# Vivado block design design_1, xczu28dr-ffvg1517-2-e, Vivado 2021.1
# (continued, part 2 of 8)
current_bd_instance /chan1/GPIO

# ---- hierarchy /chan1/psb_out_post ----
current_bd_instance /chan1/psb_out_post
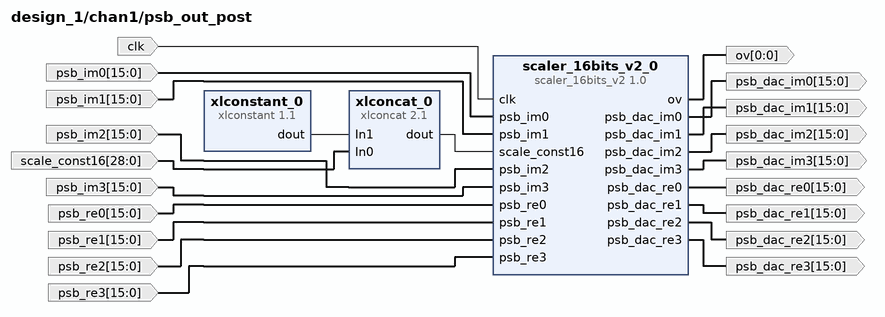
[diagram p11: block diagram inside /chan1/psb_out_post]
create_bd_pin -dir I -from 15 -to 0 psb_im0
create_bd_pin -dir I -from 15 -to 0 psb_im1
create_bd_pin -dir I -from 15 -to 0 psb_im2
create_bd_pin -dir I -from 15 -to 0 psb_im3
create_bd_pin -dir I -from 15 -to 0 psb_re0
create_bd_pin -dir I -from 15 -to 0 psb_re1
create_bd_pin -dir I -from 15 -to 0 psb_re2
create_bd_pin -dir I -from 15 -to 0 psb_re3
create_bd_pin -dir I -from 28 -to 0 scale_const16
create_bd_pin -dir I -type clk clk
create_bd_pin -dir O -from 15 -to 0 psb_dac_im0
create_bd_pin -dir O -from 15 -to 0 psb_dac_im1
create_bd_pin -dir O -from 15 -to 0 psb_dac_im2
create_bd_pin -dir O -from 15 -to 0 psb_dac_im3
create_bd_pin -dir O -from 15 -to 0 psb_dac_re0
create_bd_pin -dir O -from 15 -to 0 psb_dac_re1
create_bd_pin -dir O -from 15 -to 0 psb_dac_re2
create_bd_pin -dir O -from 15 -to 0 psb_dac_re3
create_bd_pin -dir O -from 0 -to 0 ov

create_bd_cell -type ip -vlnv xilinx.com:user:scaler_16bits_v2:1.0 scaler_16bits_v2_0
create_bd_cell -type ip -vlnv xilinx.com:ip:xlconcat:2.1 xlconcat_0
set_property -dict {CONFIG.IN0_WIDTH 29 CONFIG.IN1_WIDTH 3} [get_bd_cells xlconcat_0]
create_bd_cell -type ip -vlnv xilinx.com:ip:xlconstant:1.1 xlconstant_0
set_property -dict {CONFIG.CONST_VAL 0 CONFIG.CONST_WIDTH 3} [get_bd_cells xlconstant_0]

# ---- hierarchy /chan1/fine_nco ----
current_bd_instance /chan1/fine_nco
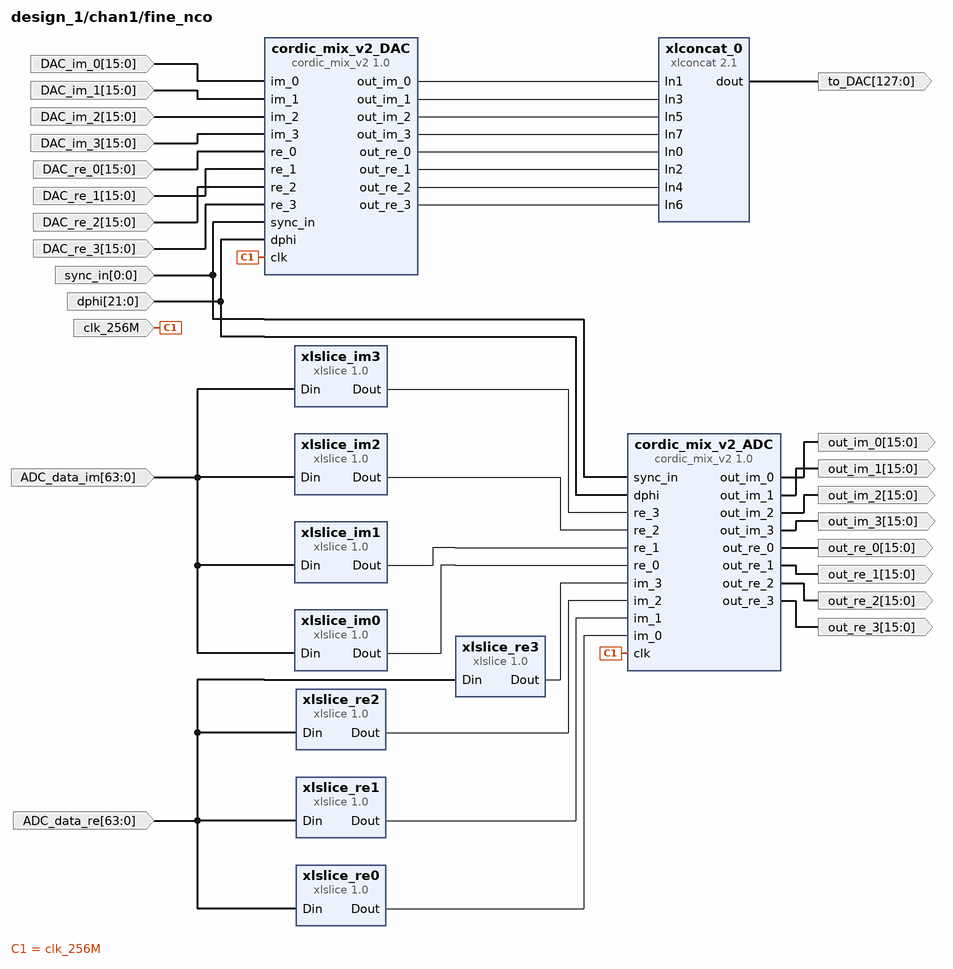
[diagram p12: block diagram inside /chan1/fine_nco]
create_bd_pin -dir I -from 63 -to 0 ADC_data_im
create_bd_pin -dir O -from 127 -to 0 to_DAC
create_bd_pin -dir I -from 63 -to 0 ADC_data_re
create_bd_pin -dir I -from 21 -to 0 dphi
create_bd_pin -dir I -from 0 -to 0 sync_in
create_bd_pin -dir I -type clk clk_256M
create_bd_pin -dir O -from 15 -to 0 out_im_0
create_bd_pin -dir O -from 15 -to 0 out_im_1
create_bd_pin -dir O -from 15 -to 0 out_im_2
create_bd_pin -dir O -from 15 -to 0 out_im_3
create_bd_pin -dir O -from 15 -to 0 out_re_0
create_bd_pin -dir O -from 15 -to 0 out_re_1
create_bd_pin -dir O -from 15 -to 0 out_re_2
create_bd_pin -dir O -from 15 -to 0 out_re_3
create_bd_pin -dir I -from 15 -to 0 DAC_im_0
create_bd_pin -dir I -from 15 -to 0 DAC_im_1
create_bd_pin -dir I -from 15 -to 0 DAC_im_2
create_bd_pin -dir I -from 15 -to 0 DAC_im_3
create_bd_pin -dir I -from 15 -to 0 DAC_re_0
create_bd_pin -dir I -from 15 -to 0 DAC_re_1
create_bd_pin -dir I -from 15 -to 0 DAC_re_2
create_bd_pin -dir I -from 15 -to 0 DAC_re_3

create_bd_cell -type ip -vlnv xilinx.com:ip:xlslice:1.0 xlslice_im0
set_property -dict {CONFIG.DIN_FROM 15 CONFIG.DIN_TO 0 CONFIG.DIN_WIDTH 64 CONFIG.DOUT_WIDTH 16} [get_bd_cells xlslice_im0]
create_bd_cell -type ip -vlnv xilinx.com:ip:xlslice:1.0 xlslice_im1
set_property -dict {CONFIG.DIN_FROM 31 CONFIG.DIN_TO 16 CONFIG.DIN_WIDTH 64 CONFIG.DOUT_WIDTH 16} [get_bd_cells xlslice_im1]
create_bd_cell -type ip -vlnv xilinx.com:ip:xlslice:1.0 xlslice_im2
set_property -dict {CONFIG.DIN_FROM 47 CONFIG.DIN_TO 32 CONFIG.DIN_WIDTH 64 CONFIG.DOUT_WIDTH 16} [get_bd_cells xlslice_im2]
create_bd_cell -type ip -vlnv xilinx.com:ip:xlconcat:2.1 xlconcat_0
set_property -dict [list \
  CONFIG.IN2_WIDTH 16 \
  CONFIG.IN3_WIDTH 16 \
  CONFIG.IN4_WIDTH 16 \
  CONFIG.IN5_WIDTH 16 \
  CONFIG.IN6_WIDTH 16 \
  CONFIG.IN7_WIDTH 16 \
  CONFIG.NUM_PORTS 8 \
] [get_bd_cells xlconcat_0]
create_bd_cell -type ip -vlnv xilinx.com:ip:xlslice:1.0 xlslice_re0
set_property -dict {CONFIG.DIN_FROM 15 CONFIG.DIN_TO 0 CONFIG.DIN_WIDTH 64 CONFIG.DOUT_WIDTH 16} [get_bd_cells xlslice_re0]
create_bd_cell -type ip -vlnv xilinx.com:ip:xlslice:1.0 xlslice_im3
set_property -dict {CONFIG.DIN_FROM 63 CONFIG.DIN_TO 48 CONFIG.DIN_WIDTH 64 CONFIG.DOUT_WIDTH 16} [get_bd_cells xlslice_im3]
create_bd_cell -type ip -vlnv xilinx.com:ip:xlslice:1.0 xlslice_re1
set_property -dict {CONFIG.DIN_FROM 31 CONFIG.DIN_TO 16 CONFIG.DIN_WIDTH 64 CONFIG.DOUT_WIDTH 16} [get_bd_cells xlslice_re1]
create_bd_cell -type ip -vlnv xilinx.com:ip:xlslice:1.0 xlslice_re2
set_property -dict {CONFIG.DIN_FROM 47 CONFIG.DIN_TO 32 CONFIG.DIN_WIDTH 64 CONFIG.DOUT_WIDTH 16} [get_bd_cells xlslice_re2]
create_bd_cell -type ip -vlnv xilinx.com:user:cordic_mix_v2:1.0 cordic_mix_v2_ADC
create_bd_cell -type ip -vlnv xilinx.com:user:cordic_mix_v2:1.0 cordic_mix_v2_DAC
create_bd_cell -type ip -vlnv xilinx.com:ip:xlslice:1.0 xlslice_re3
set_property -dict {CONFIG.DIN_FROM 63 CONFIG.DIN_TO 48 CONFIG.DIN_WIDTH 64 CONFIG.DOUT_WIDTH 16} [get_bd_cells xlslice_re3]

# ---- hierarchy /chan1/overflow_management ----
current_bd_instance /chan1/overflow_management
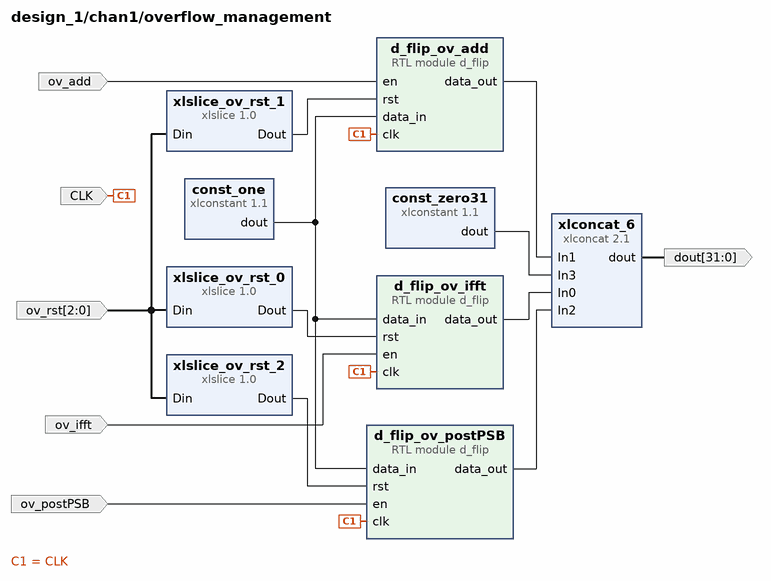
[diagram p13: block diagram inside /chan1/overflow_management]
create_bd_pin -dir I -type clk CLK
create_bd_pin -dir O -from 31 -to 0 dout
create_bd_pin -dir I ov_add
create_bd_pin -dir I ov_ifft
create_bd_pin -dir I ov_postPSB
create_bd_pin -dir I -from 2 -to 0 ov_rst

create_bd_cell -type ip -vlnv xilinx.com:ip:xlconstant:1.1 const_one
set_property -dict {CONFIG.CONST_VAL 1 CONFIG.CONST_WIDTH 1} [get_bd_cells const_one]
create_bd_cell -type ip -vlnv xilinx.com:ip:xlconstant:1.1 const_zero31
set_property -dict {CONFIG.CONST_VAL 0 CONFIG.CONST_WIDTH 29} [get_bd_cells const_zero31]
create_bd_cell -type module -reference d_flip d_flip_ov_add
set_property -dict {CONFIG.width 1} [get_bd_cells d_flip_ov_add]
create_bd_cell -type module -reference d_flip d_flip_ov_ifft
set_property -dict {CONFIG.width 1} [get_bd_cells d_flip_ov_ifft]
create_bd_cell -type module -reference d_flip d_flip_ov_postPSB
set_property -dict {CONFIG.width 1} [get_bd_cells d_flip_ov_postPSB]
create_bd_cell -type ip -vlnv xilinx.com:ip:xlconcat:2.1 xlconcat_6
set_property -dict [list \
  CONFIG.IN0_WIDTH 1 \
  CONFIG.IN1_WIDTH 1 \
  CONFIG.IN2_WIDTH 1 \
  CONFIG.IN3_WIDTH 29 \
  CONFIG.IN4_WIDTH 16 \
  CONFIG.IN5_WIDTH 16 \
  CONFIG.IN6_WIDTH 16 \
  CONFIG.IN7_WIDTH 16 \
  CONFIG.NUM_PORTS 4 \
] [get_bd_cells xlconcat_6]
create_bd_cell -type ip -vlnv xilinx.com:ip:xlslice:1.0 xlslice_ov_rst_0
set_property -dict {CONFIG.DIN_FROM 0 CONFIG.DIN_TO 0 CONFIG.DIN_WIDTH 3 CONFIG.DOUT_WIDTH 1} [get_bd_cells xlslice_ov_rst_0]
create_bd_cell -type ip -vlnv xilinx.com:ip:xlslice:1.0 xlslice_ov_rst_1
set_property -dict {CONFIG.DIN_FROM 1 CONFIG.DIN_TO 1 CONFIG.DIN_WIDTH 3 CONFIG.DOUT_WIDTH 1} [get_bd_cells xlslice_ov_rst_1]
create_bd_cell -type ip -vlnv xilinx.com:ip:xlslice:1.0 xlslice_ov_rst_2
set_property -dict {CONFIG.DIN_FROM 2 CONFIG.DIN_TO 2 CONFIG.DIN_WIDTH 3 CONFIG.DOUT_WIDTH 1} [get_bd_cells xlslice_ov_rst_2]

# ---- hierarchy /chan2 ----
current_bd_instance /chan2
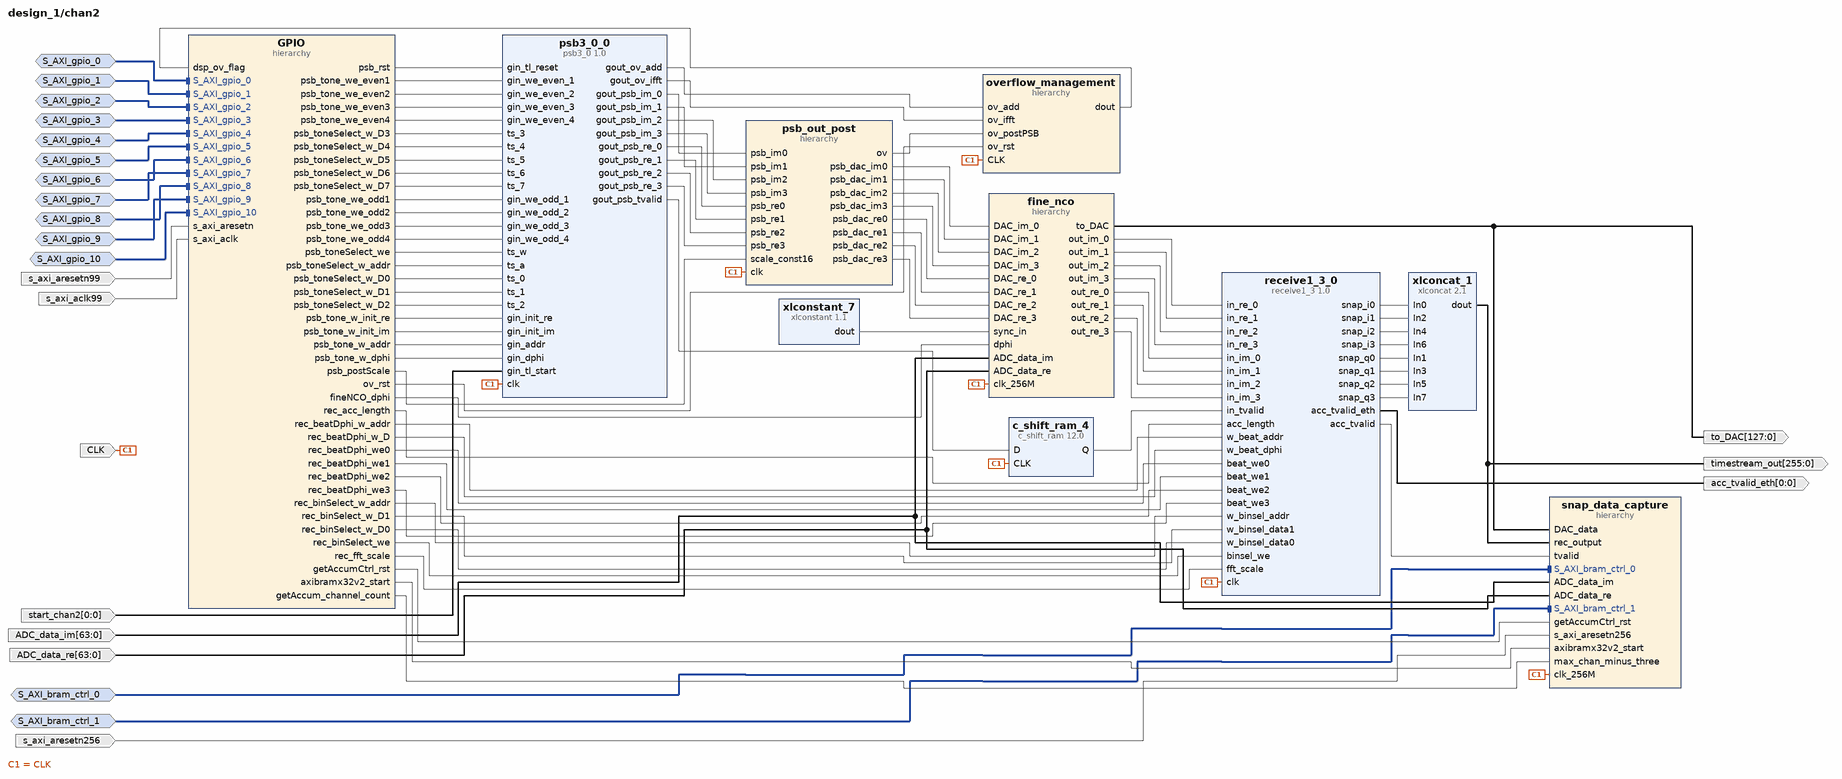
[diagram p14: block diagram inside /chan2]
create_bd_intf_pin -mode Slave -vlnv xilinx.com:interface:aximm_rtl:1.0 S_AXI_bram_ctrl_0
create_bd_intf_pin -mode Slave -vlnv xilinx.com:interface:aximm_rtl:1.0 S_AXI_bram_ctrl_1
create_bd_intf_pin -mode Slave -vlnv xilinx.com:interface:aximm_rtl:1.0 S_AXI_gpio_6
create_bd_intf_pin -mode Slave -vlnv xilinx.com:interface:aximm_rtl:1.0 S_AXI_gpio_7
create_bd_intf_pin -mode Slave -vlnv xilinx.com:interface:aximm_rtl:1.0 S_AXI_gpio_8
create_bd_intf_pin -mode Slave -vlnv xilinx.com:interface:aximm_rtl:1.0 S_AXI_gpio_9
create_bd_intf_pin -mode Slave -vlnv xilinx.com:interface:aximm_rtl:1.0 S_AXI_gpio_0
create_bd_intf_pin -mode Slave -vlnv xilinx.com:interface:aximm_rtl:1.0 S_AXI_gpio_1
create_bd_intf_pin -mode Slave -vlnv xilinx.com:interface:aximm_rtl:1.0 S_AXI_gpio_2
create_bd_intf_pin -mode Slave -vlnv xilinx.com:interface:aximm_rtl:1.0 S_AXI_gpio_3
create_bd_intf_pin -mode Slave -vlnv xilinx.com:interface:aximm_rtl:1.0 S_AXI_gpio_4
create_bd_intf_pin -mode Slave -vlnv xilinx.com:interface:aximm_rtl:1.0 S_AXI_gpio_10
create_bd_intf_pin -mode Slave -vlnv xilinx.com:interface:aximm_rtl:1.0 S_AXI_gpio_5
create_bd_pin -dir I -type clk CLK
create_bd_pin -dir O -from 0 -to 0 acc_tvalid_eth
create_bd_pin -dir O -from 255 -to 0 -type data timestream_out
create_bd_pin -dir I -from 63 -to 0 ADC_data_re
create_bd_pin -dir I -type rst s_axi_aresetn256
create_bd_pin -dir I -from 63 -to 0 ADC_data_im
create_bd_pin -dir O -from 127 -to 0 to_DAC
create_bd_pin -dir I -type clk s_axi_aclk99
create_bd_pin -dir I -type rst s_axi_aresetn99
create_bd_pin -dir I -from 0 -to 0 start_chan2

create_bd_cell -type ip -vlnv xilinx.com:user:receive1_3:1.0 receive1_3_0
create_bd_cell -type ip -vlnv xilinx.com:ip:c_shift_ram:12.0 c_shift_ram_4
set_property -dict {CONFIG.AsyncInitVal 0 CONFIG.DefaultData 0 CONFIG.Depth 1024 CONFIG.Width 1} [get_bd_cells c_shift_ram_4]
create_bd_cell -type ip -vlnv xilinx.com:ip:xlconcat:2.1 xlconcat_1
set_property -dict [list \
  CONFIG.IN0_WIDTH 32 \
  CONFIG.IN1_WIDTH 32 \
  CONFIG.IN2_WIDTH 32 \
  CONFIG.IN3_WIDTH 32 \
  CONFIG.IN4_WIDTH 32 \
  CONFIG.IN5_WIDTH 32 \
  CONFIG.IN6_WIDTH 32 \
  CONFIG.IN7_WIDTH 32 \
  CONFIG.NUM_PORTS 8 \
] [get_bd_cells xlconcat_1]
create_bd_cell -type ip -vlnv xilinx.com:user:psb3_0:1.0 psb3_0_0
create_bd_cell -type ip -vlnv xilinx.com:ip:xlconstant:1.1 xlconstant_7
set_property -dict {CONFIG.CONST_VAL 1 CONFIG.CONST_WIDTH 1} [get_bd_cells xlconstant_7]
create_bd_cell -type hier snap_data_capture
create_bd_cell -type hier GPIO
create_bd_cell -type hier psb_out_post
create_bd_cell -type hier fine_nco
create_bd_cell -type hier overflow_management

# ---- hierarchy /chan2/snap_data_capture ----
current_bd_instance /chan2/snap_data_capture
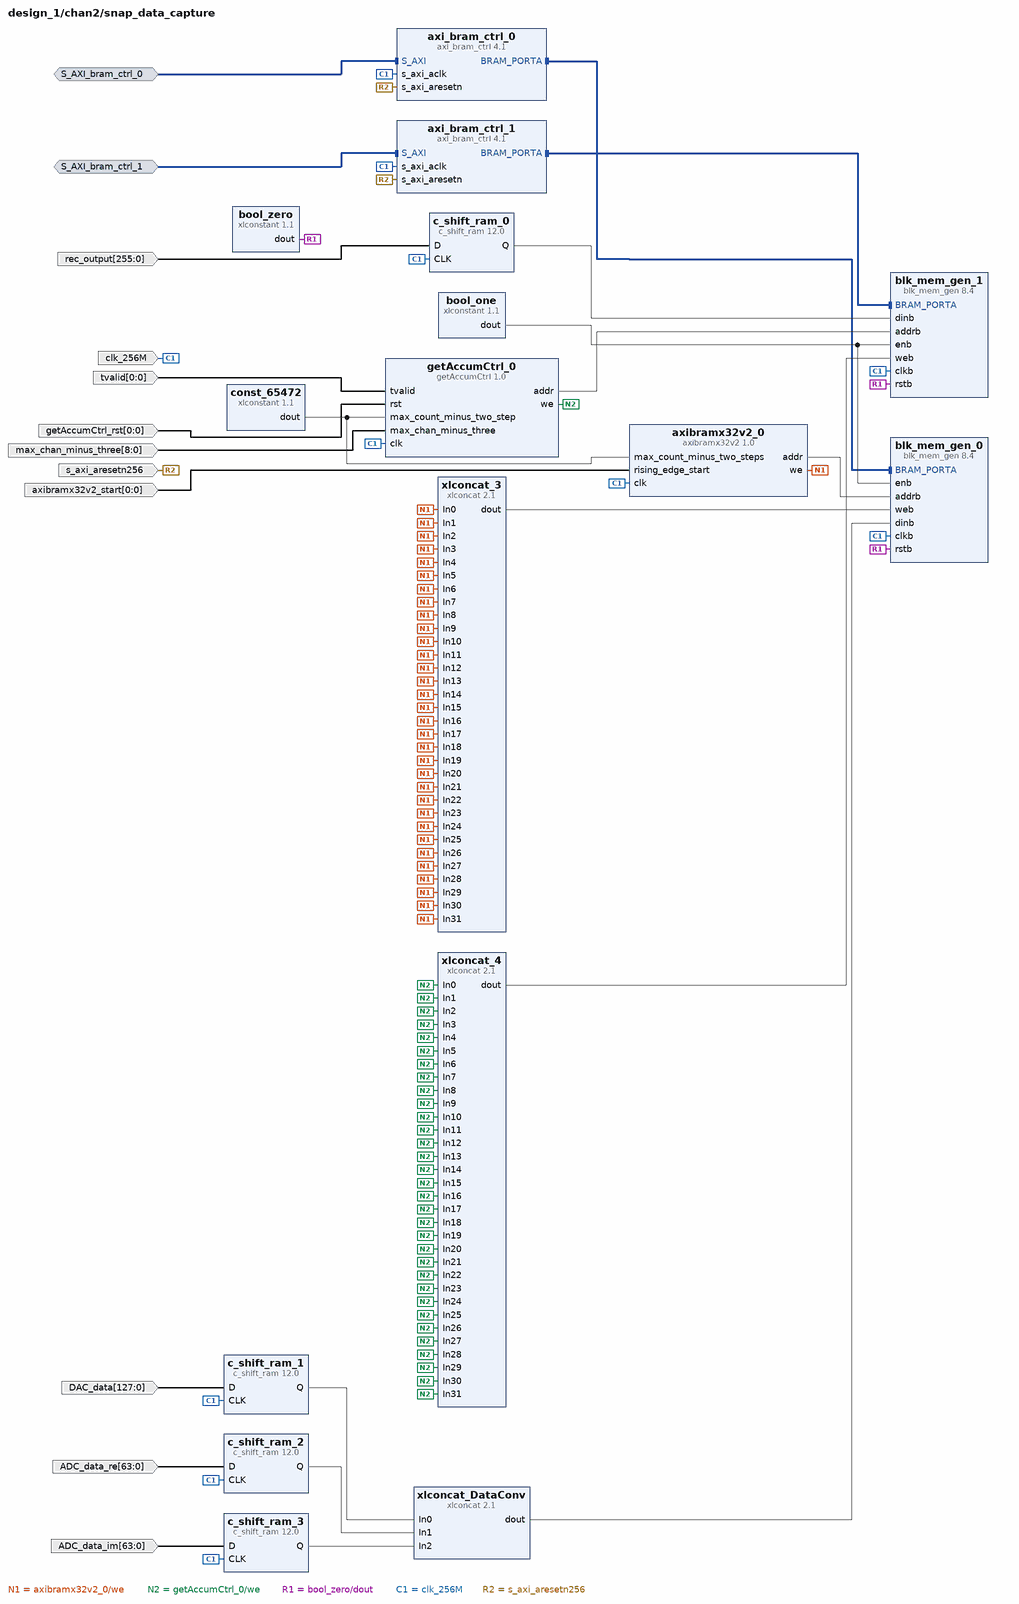
[diagram p15: block diagram inside /chan2/snap_data_capture]
create_bd_intf_pin -mode Slave -vlnv xilinx.com:interface:aximm_rtl:1.0 S_AXI_bram_ctrl_0
create_bd_intf_pin -mode Slave -vlnv xilinx.com:interface:aximm_rtl:1.0 S_AXI_bram_ctrl_1
create_bd_pin -dir I -from 63 -to 0 -type data ADC_data_re
create_bd_pin -dir I -type clk clk_256M
create_bd_pin -dir I -type rst s_axi_aresetn256
create_bd_pin -dir I -from 63 -to 0 -type data ADC_data_im
create_bd_pin -dir I -from 8 -to 0 max_chan_minus_three
create_bd_pin -dir I -from 0 -to 0 getAccumCtrl_rst
create_bd_pin -dir I -from 0 -to 0 tvalid
create_bd_pin -dir I -from 255 -to 0 -type data rec_output
create_bd_pin -dir I -from 127 -to 0 -type data DAC_data
create_bd_pin -dir I -from 0 -to 0 axibramx32v2_start

create_bd_cell -type ip -vlnv xilinx.com:ip:xlconstant:1.1 const_65472
set_property -dict {CONFIG.CONST_VAL 65472 CONFIG.CONST_WIDTH 32} [get_bd_cells const_65472]
create_bd_cell -type ip -vlnv xilinx.com:ip:c_shift_ram:12.0 c_shift_ram_2
set_property -dict [list \
  CONFIG.AsyncInitVal 0000000000000000000000000000000000000000000000000000000000000000 \
  CONFIG.DefaultData 0000000000000000000000000000000000000000000000000000000000000000 \
  CONFIG.Depth 2 \
  CONFIG.Width 64 \
] [get_bd_cells c_shift_ram_2]
create_bd_cell -type ip -vlnv xilinx.com:ip:axi_bram_ctrl:4.1 axi_bram_ctrl_0
set_property -dict {CONFIG.DATA_WIDTH 256 CONFIG.SINGLE_PORT_BRAM 1} [get_bd_cells axi_bram_ctrl_0]
create_bd_cell -type ip -vlnv xilinx.com:ip:axi_bram_ctrl:4.1 axi_bram_ctrl_1
set_property -dict {CONFIG.DATA_WIDTH 256 CONFIG.SINGLE_PORT_BRAM 1} [get_bd_cells axi_bram_ctrl_1]
create_bd_cell -type ip -vlnv xilinx.com:ip:c_shift_ram:12.0 c_shift_ram_3
set_property -dict [list \
  CONFIG.AsyncInitVal 0000000000000000000000000000000000000000000000000000000000000000 \
  CONFIG.DefaultData 0000000000000000000000000000000000000000000000000000000000000000 \
  CONFIG.Depth 2 \
  CONFIG.Width 64 \
] [get_bd_cells c_shift_ram_3]
create_bd_cell -type ip -vlnv xilinx.com:user:getAccumCtrl:1.0 getAccumCtrl_0
create_bd_cell -type ip -vlnv xilinx.com:ip:xlconstant:1.1 bool_zero
set_property -dict {CONFIG.CONST_VAL 0 CONFIG.CONST_WIDTH 1} [get_bd_cells bool_zero]
create_bd_cell -type ip -vlnv xilinx.com:ip:xlconcat:2.1 xlconcat_3
set_property -dict [list \
  CONFIG.IN0_WIDTH 1 \
  CONFIG.IN10_WIDTH 1 \
  CONFIG.IN11_WIDTH 1 \
  CONFIG.IN12_WIDTH 1 \
  CONFIG.IN13_WIDTH 1 \
  CONFIG.IN14_WIDTH 1 \
  CONFIG.IN15_WIDTH 1 \
  CONFIG.IN16_WIDTH 1 \
  CONFIG.IN17_WIDTH 1 \
  CONFIG.IN18_WIDTH 1 \
  CONFIG.IN19_WIDTH 1 \
  CONFIG.IN1_WIDTH 1 \
  CONFIG.IN20_WIDTH 1 \
  CONFIG.IN21_WIDTH 1 \
  CONFIG.IN22_WIDTH 1 \
  CONFIG.IN23_WIDTH 1 \
  CONFIG.IN24_WIDTH 1 \
  CONFIG.IN25_WIDTH 1 \
  CONFIG.IN26_WIDTH 1 \
  CONFIG.IN27_WIDTH 1 \
  CONFIG.IN28_WIDTH 1 \
  CONFIG.IN29_WIDTH 1 \
  CONFIG.IN2_WIDTH 1 \
  CONFIG.IN30_WIDTH 1 \
  CONFIG.IN31_WIDTH 1 \
  CONFIG.IN3_WIDTH 1 \
  CONFIG.IN4_WIDTH 1 \
  CONFIG.IN5_WIDTH 1 \
  CONFIG.IN6_WIDTH 1 \
  CONFIG.IN7_WIDTH 1 \
  CONFIG.IN8_WIDTH 1 \
  CONFIG.IN9_WIDTH 1 \
  CONFIG.NUM_PORTS 32 \
] [get_bd_cells xlconcat_3]
create_bd_cell -type ip -vlnv xilinx.com:ip:blk_mem_gen:8.4 blk_mem_gen_0
set_property -dict [list \
  CONFIG.Enable_32bit_Address true \
  CONFIG.Memory_Type True_Dual_Port_RAM \
  CONFIG.PRIM_type_to_Implement URAM \
  CONFIG.Port_B_Clock 100 \
  CONFIG.Port_B_Enable_Rate 100 \
  CONFIG.Port_B_Write_Rate 50 \
  CONFIG.Use_RSTA_Pin true \
  CONFIG.Use_RSTB_Pin true \
  CONFIG.Write_Width_A 256 \
  CONFIG.use_bram_block BRAM_Controller \
] [get_bd_cells blk_mem_gen_0]
create_bd_cell -type ip -vlnv xilinx.com:ip:blk_mem_gen:8.4 blk_mem_gen_1
set_property -dict [list \
  CONFIG.Enable_32bit_Address true \
  CONFIG.Memory_Type True_Dual_Port_RAM \
  CONFIG.PRIM_type_to_Implement URAM \
  CONFIG.Port_B_Clock 100 \
  CONFIG.Port_B_Enable_Rate 100 \
  CONFIG.Port_B_Write_Rate 50 \
  CONFIG.Use_RSTA_Pin true \
  CONFIG.Use_RSTB_Pin true \
  CONFIG.Write_Width_A 256 \
  CONFIG.use_bram_block BRAM_Controller \
] [get_bd_cells blk_mem_gen_1]
create_bd_cell -type ip -vlnv xilinx.com:ip:xlconstant:1.1 bool_one
set_property -dict {CONFIG.CONST_VAL 1 CONFIG.CONST_WIDTH 1} [get_bd_cells bool_one]
create_bd_cell -type ip -vlnv xilinx.com:ip:xlconcat:2.1 xlconcat_DataConv
set_property -dict [list \
  CONFIG.IN0_WIDTH 128 \
  CONFIG.IN1_WIDTH 64 \
  CONFIG.IN2_WIDTH 64 \
  CONFIG.IN3_WIDTH 32 \
  CONFIG.IN4_WIDTH 32 \
  CONFIG.IN5_WIDTH 32 \
  CONFIG.IN6_WIDTH 32 \
  CONFIG.IN7_WIDTH 32 \
  CONFIG.NUM_PORTS 3 \
] [get_bd_cells xlconcat_DataConv]
create_bd_cell -type ip -vlnv xilinx.com:ip:c_shift_ram:12.0 c_shift_ram_0
set_property -dict [list \
  CONFIG.AsyncInitVal 0000000000000000000000000000000000000000000000000000000000000000000000000000000000000000000000000000000000000000000000000000000000000000000000000000000000000000000000000000000000000000000000000000000000000000000000000000000000000000000000000000000000000000 \
  CONFIG.DefaultData 0000000000000000000000000000000000000000000000000000000000000000000000000000000000000000000000000000000000000000000000000000000000000000000000000000000000000000000000000000000000000000000000000000000000000000000000000000000000000000000000000000000000000000 \
  CONFIG.Depth 3 \
  CONFIG.Width 256 \
] [get_bd_cells c_shift_ram_0]
create_bd_cell -type ip -vlnv xilinx.com:ip:c_shift_ram:12.0 c_shift_ram_1
set_property -dict [list \
  CONFIG.AsyncInitVal 00000000000000000000000000000000000000000000000000000000000000000000000000000000000000000000000000000000000000000000000000000000 \
  CONFIG.DefaultData 00000000000000000000000000000000000000000000000000000000000000000000000000000000000000000000000000000000000000000000000000000000 \
  CONFIG.Depth 2 \
  CONFIG.Width 128 \
] [get_bd_cells c_shift_ram_1]
create_bd_cell -type ip -vlnv xilinx.com:user:axibramx32v2:1.0 axibramx32v2_0
create_bd_cell -type ip -vlnv xilinx.com:ip:xlconcat:2.1 xlconcat_4
set_property -dict [list \
  CONFIG.IN0_WIDTH 1 \
  CONFIG.IN10_WIDTH 1 \
  CONFIG.IN11_WIDTH 1 \
  CONFIG.IN12_WIDTH 1 \
  CONFIG.IN13_WIDTH 1 \
  CONFIG.IN14_WIDTH 1 \
  CONFIG.IN15_WIDTH 1 \
  CONFIG.IN16_WIDTH 1 \
  CONFIG.IN17_WIDTH 1 \
  CONFIG.IN18_WIDTH 1 \
  CONFIG.IN19_WIDTH 1 \
  CONFIG.IN1_WIDTH 1 \
  CONFIG.IN20_WIDTH 1 \
  CONFIG.IN21_WIDTH 1 \
  CONFIG.IN22_WIDTH 1 \
  CONFIG.IN23_WIDTH 1 \
  CONFIG.IN24_WIDTH 1 \
  CONFIG.IN25_WIDTH 1 \
  CONFIG.IN26_WIDTH 1 \
  CONFIG.IN27_WIDTH 1 \
  CONFIG.IN28_WIDTH 1 \
  CONFIG.IN29_WIDTH 1 \
  CONFIG.IN2_WIDTH 1 \
  CONFIG.IN30_WIDTH 1 \
  CONFIG.IN31_WIDTH 1 \
  CONFIG.IN3_WIDTH 1 \
  CONFIG.IN4_WIDTH 1 \
  CONFIG.IN5_WIDTH 1 \
  CONFIG.IN6_WIDTH 1 \
  CONFIG.IN7_WIDTH 1 \
  CONFIG.IN8_WIDTH 1 \
  CONFIG.IN9_WIDTH 1 \
  CONFIG.NUM_PORTS 32 \
] [get_bd_cells xlconcat_4]

# ---- hierarchy /chan2/GPIO ----
current_bd_instance /chan2/GPIO
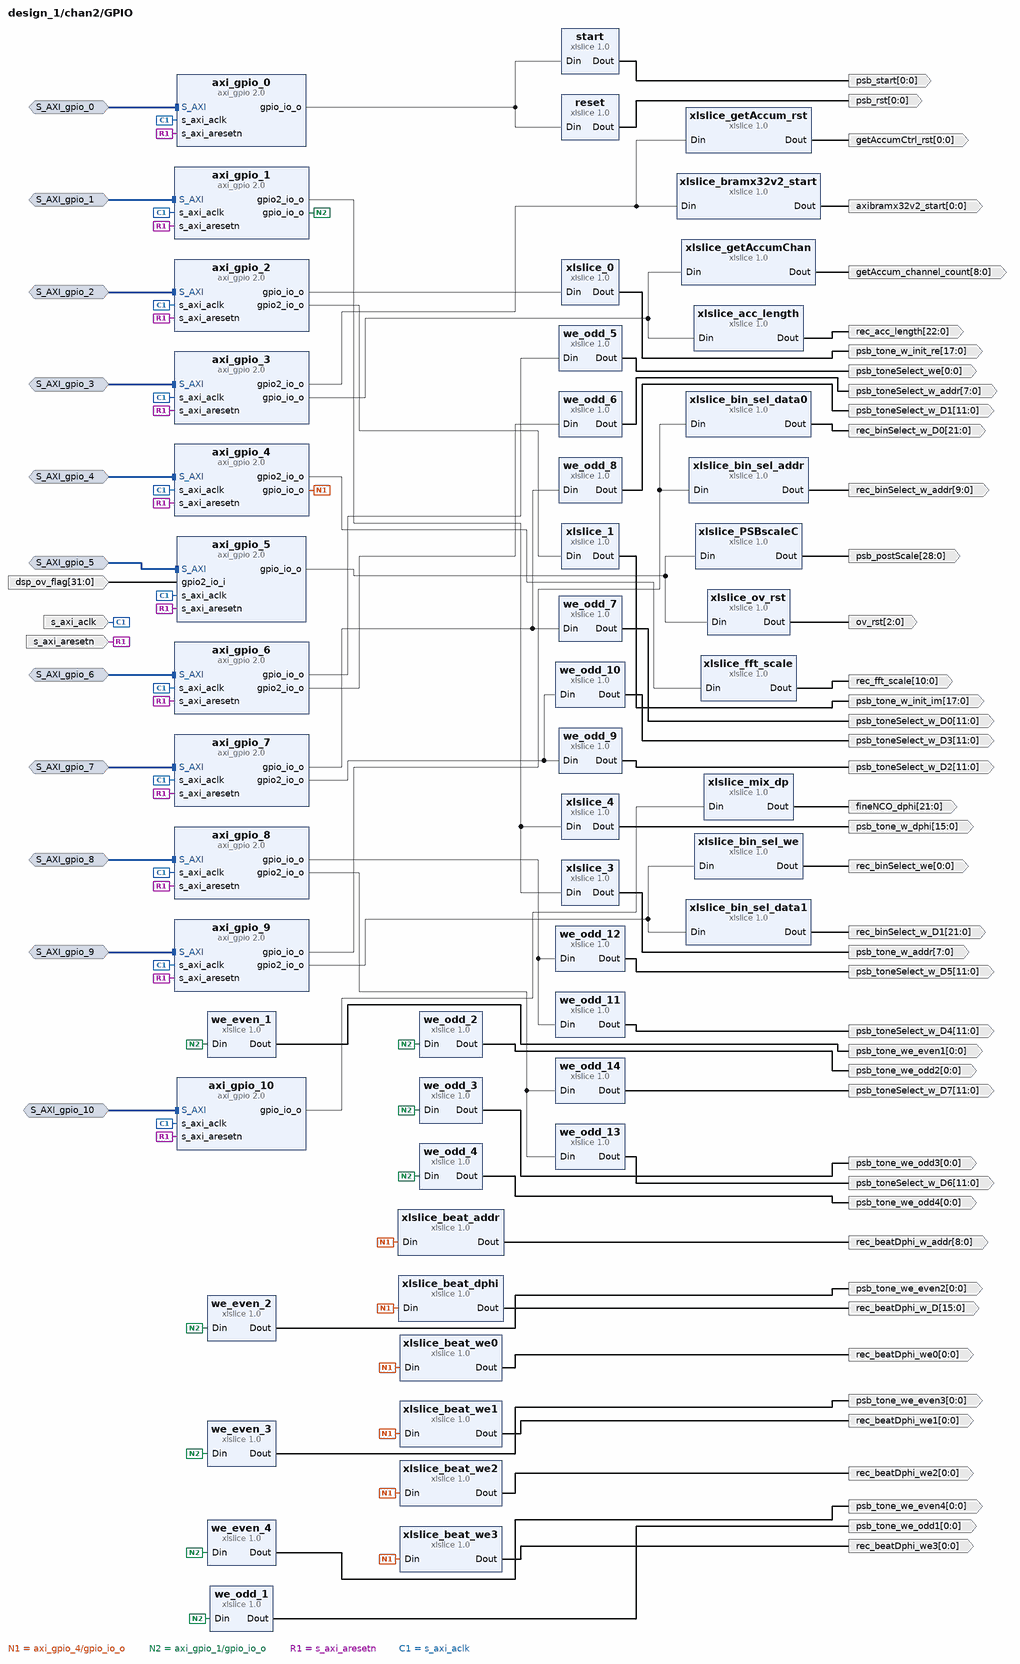
[diagram p16: block diagram inside /chan2/GPIO]
create_bd_intf_pin -mode Slave -vlnv xilinx.com:interface:aximm_rtl:1.0 S_AXI_gpio_6
create_bd_intf_pin -mode Slave -vlnv xilinx.com:interface:aximm_rtl:1.0 S_AXI_gpio_7
create_bd_intf_pin -mode Slave -vlnv xilinx.com:interface:aximm_rtl:1.0 S_AXI_gpio_8
create_bd_intf_pin -mode Slave -vlnv xilinx.com:interface:aximm_rtl:1.0 S_AXI_gpio_9
create_bd_intf_pin -mode Slave -vlnv xilinx.com:interface:aximm_rtl:1.0 S_AXI_gpio_0
create_bd_intf_pin -mode Slave -vlnv xilinx.com:interface:aximm_rtl:1.0 S_AXI_gpio_1
create_bd_intf_pin -mode Slave -vlnv xilinx.com:interface:aximm_rtl:1.0 S_AXI_gpio_2
create_bd_intf_pin -mode Slave -vlnv xilinx.com:interface:aximm_rtl:1.0 S_AXI_gpio_3
create_bd_intf_pin -mode Slave -vlnv xilinx.com:interface:aximm_rtl:1.0 S_AXI_gpio_4
create_bd_intf_pin -mode Slave -vlnv xilinx.com:interface:aximm_rtl:1.0 S_AXI_gpio_10
create_bd_intf_pin -mode Slave -vlnv xilinx.com:interface:aximm_rtl:1.0 S_AXI_gpio_5
create_bd_pin -dir O -from 21 -to 0 fineNCO_dphi
create_bd_pin -dir O -from 0 -to 0 rec_beatDphi_we0
create_bd_pin -dir O -from 11 -to 0 psb_toneSelect_w_D2
create_bd_pin -dir O -from 0 -to 0 psb_tone_we_even1
create_bd_pin -dir I -type clk s_axi_aclk
create_bd_pin -dir I -type rst s_axi_aresetn
create_bd_pin -dir O -from 8 -to 0 getAccum_channel_count
create_bd_pin -dir O -from 0 -to 0 psb_tone_we_even2
create_bd_pin -dir O -from 0 -to 0 rec_beatDphi_we1
create_bd_pin -dir O -from 10 -to 0 rec_fft_scale
create_bd_pin -dir O -from 0 -to 0 rec_beatDphi_we2
create_bd_pin -dir O -from 0 -to 0 psb_tone_we_even3
create_bd_pin -dir O -from 17 -to 0 psb_tone_w_init_re
create_bd_pin -dir O -from 0 -to 0 psb_start
create_bd_pin -dir O -from 0 -to 0 psb_tone_we_even4
create_bd_pin -dir O -from 0 -to 0 rec_beatDphi_we3
create_bd_pin -dir O -from 17 -to 0 psb_tone_w_init_im
create_bd_pin -dir O -from 11 -to 0 psb_toneSelect_w_D3
create_bd_pin -dir O -from 8 -to 0 rec_beatDphi_w_addr
create_bd_pin -dir O -from 0 -to 0 rec_binSelect_we
create_bd_pin -dir O -from 11 -to 0 psb_toneSelect_w_D4
create_bd_pin -dir O -from 0 -to 0 psb_tone_we_odd1
create_bd_pin -dir O -from 0 -to 0 getAccumCtrl_rst
create_bd_pin -dir O -from 15 -to 0 rec_beatDphi_w_D
create_bd_pin -dir O -from 7 -to 0 psb_tone_w_addr
create_bd_pin -dir O -from 0 -to 0 psb_tone_we_odd2
create_bd_pin -dir O -from 11 -to 0 psb_toneSelect_w_D5
create_bd_pin -dir O -from 11 -to 0 psb_toneSelect_w_D6
create_bd_pin -dir O -from 0 -to 0 psb_tone_we_odd3
create_bd_pin -dir O -from 15 -to 0 psb_tone_w_dphi
create_bd_pin -dir O -from 0 -to 0 psb_tone_we_odd4
create_bd_pin -dir O -from 11 -to 0 psb_toneSelect_w_D7
create_bd_pin -dir O -from 0 -to 0 psb_toneSelect_we
create_bd_pin -dir O -from 9 -to 0 rec_binSelect_w_addr
create_bd_pin -dir O -from 0 -to 0 psb_rst
create_bd_pin -dir O -from 7 -to 0 psb_toneSelect_w_addr
create_bd_pin -dir O -from 21 -to 0 rec_binSelect_w_D0
create_bd_pin -dir O -from 11 -to 0 psb_toneSelect_w_D0
create_bd_pin -dir O -from 22 -to 0 rec_acc_length
create_bd_pin -dir O -from 11 -to 0 psb_toneSelect_w_D1
create_bd_pin -dir O -from 21 -to 0 rec_binSelect_w_D1
create_bd_pin -dir O -from 0 -to 0 axibramx32v2_start
create_bd_pin -dir I -from 31 -to 0 dsp_ov_flag
create_bd_pin -dir O -from 28 -to 0 psb_postScale
create_bd_pin -dir O -from 2 -to 0 ov_rst

create_bd_cell -type ip -vlnv xilinx.com:ip:xlslice:1.0 xlslice_mix_dp
set_property -dict {CONFIG.DIN_FROM 21 CONFIG.DIN_TO 0 CONFIG.DOUT_WIDTH 22} [get_bd_cells xlslice_mix_dp]
create_bd_cell -type ip -vlnv xilinx.com:ip:xlslice:1.0 xlslice_beat_we0
set_property -dict {CONFIG.DIN_FROM 0 CONFIG.DIN_TO 0 CONFIG.DOUT_WIDTH 1} [get_bd_cells xlslice_beat_we0]
create_bd_cell -type ip -vlnv xilinx.com:ip:xlslice:1.0 we_odd_9
set_property -dict {CONFIG.DIN_FROM 11 CONFIG.DIN_TO 0 CONFIG.DOUT_WIDTH 12} [get_bd_cells we_odd_9]
create_bd_cell -type ip -vlnv xilinx.com:ip:xlslice:1.0 we_even_1
set_property -dict {CONFIG.DIN_FROM 0 CONFIG.DOUT_WIDTH 1} [get_bd_cells we_even_1]
create_bd_cell -type ip -vlnv xilinx.com:ip:axi_gpio:2.0 axi_gpio_6
set_property -dict {CONFIG.C_ALL_OUTPUTS 1 CONFIG.C_ALL_OUTPUTS_2 1 CONFIG.C_IS_DUAL 1} [get_bd_cells axi_gpio_6]
create_bd_cell -type ip -vlnv xilinx.com:ip:xlslice:1.0 xlslice_getAccumChan
set_property -dict {CONFIG.DIN_FROM 31 CONFIG.DIN_TO 23 CONFIG.DOUT_WIDTH 9} [get_bd_cells xlslice_getAccumChan]
create_bd_cell -type ip -vlnv xilinx.com:ip:axi_gpio:2.0 axi_gpio_7
set_property -dict {CONFIG.C_ALL_OUTPUTS 1 CONFIG.C_ALL_OUTPUTS_2 1 CONFIG.C_IS_DUAL 1} [get_bd_cells axi_gpio_7]
create_bd_cell -type ip -vlnv xilinx.com:ip:xlslice:1.0 we_even_2
set_property -dict {CONFIG.DIN_FROM 1 CONFIG.DIN_TO 1 CONFIG.DOUT_WIDTH 1} [get_bd_cells we_even_2]
create_bd_cell -type ip -vlnv xilinx.com:ip:xlslice:1.0 xlslice_beat_we1
set_property -dict {CONFIG.DIN_FROM 1 CONFIG.DIN_TO 1 CONFIG.DOUT_WIDTH 1} [get_bd_cells xlslice_beat_we1]
create_bd_cell -type ip -vlnv xilinx.com:ip:xlslice:1.0 xlslice_fft_scale
set_property -dict {CONFIG.DIN_FROM 10 CONFIG.DIN_TO 0 CONFIG.DOUT_WIDTH 11} [get_bd_cells xlslice_fft_scale]
create_bd_cell -type ip -vlnv xilinx.com:ip:xlslice:1.0 xlslice_beat_we2
set_property -dict {CONFIG.DIN_FROM 2 CONFIG.DIN_TO 2 CONFIG.DOUT_WIDTH 1} [get_bd_cells xlslice_beat_we2]
create_bd_cell -type ip -vlnv xilinx.com:ip:xlslice:1.0 we_even_3
set_property -dict {CONFIG.DIN_FROM 2 CONFIG.DIN_TO 2 CONFIG.DOUT_WIDTH 1} [get_bd_cells we_even_3]
create_bd_cell -type ip -vlnv xilinx.com:ip:axi_gpio:2.0 axi_gpio_8
set_property -dict {CONFIG.C_ALL_OUTPUTS 1 CONFIG.C_ALL_OUTPUTS_2 1 CONFIG.C_IS_DUAL 1} [get_bd_cells axi_gpio_8]
create_bd_cell -type ip -vlnv xilinx.com:ip:xlslice:1.0 xlslice_0
set_property -dict {CONFIG.DIN_FROM 17 CONFIG.DOUT_WIDTH 18} [get_bd_cells xlslice_0]
create_bd_cell -type ip -vlnv xilinx.com:ip:xlslice:1.0 start
create_bd_cell -type ip -vlnv xilinx.com:ip:axi_gpio:2.0 axi_gpio_9
set_property -dict {CONFIG.C_ALL_OUTPUTS 1 CONFIG.C_ALL_OUTPUTS_2 1 CONFIG.C_IS_DUAL 1} [get_bd_cells axi_gpio_9]
create_bd_cell -type ip -vlnv xilinx.com:ip:xlslice:1.0 we_even_4
set_property -dict {CONFIG.DIN_FROM 3 CONFIG.DIN_TO 3 CONFIG.DOUT_WIDTH 1} [get_bd_cells we_even_4]
create_bd_cell -type ip -vlnv xilinx.com:ip:xlslice:1.0 xlslice_beat_we3
set_property -dict {CONFIG.DIN_FROM 3 CONFIG.DIN_TO 3 CONFIG.DOUT_WIDTH 1} [get_bd_cells xlslice_beat_we3]
create_bd_cell -type ip -vlnv xilinx.com:ip:xlslice:1.0 xlslice_1
set_property -dict {CONFIG.DIN_FROM 17 CONFIG.DOUT_WIDTH 18} [get_bd_cells xlslice_1]
create_bd_cell -type ip -vlnv xilinx.com:ip:xlslice:1.0 we_odd_10
set_property -dict {CONFIG.DIN_FROM 23 CONFIG.DIN_TO 12 CONFIG.DOUT_WIDTH 12} [get_bd_cells we_odd_10]
create_bd_cell -type ip -vlnv xilinx.com:ip:xlslice:1.0 xlslice_beat_addr
set_property -dict {CONFIG.DIN_FROM 28 CONFIG.DIN_TO 20 CONFIG.DOUT_WIDTH 9} [get_bd_cells xlslice_beat_addr]
create_bd_cell -type ip -vlnv xilinx.com:ip:xlslice:1.0 xlslice_bin_sel_we
set_property -dict {CONFIG.DIN_FROM 0 CONFIG.DIN_TO 0 CONFIG.DOUT_WIDTH 1} [get_bd_cells xlslice_bin_sel_we]
create_bd_cell -type ip -vlnv xilinx.com:ip:xlslice:1.0 we_odd_11
set_property -dict {CONFIG.DIN_FROM 11 CONFIG.DIN_TO 0 CONFIG.DOUT_WIDTH 12} [get_bd_cells we_odd_11]
create_bd_cell -type ip -vlnv xilinx.com:ip:xlslice:1.0 we_odd_1
set_property -dict {CONFIG.DIN_FROM 4 CONFIG.DIN_TO 4 CONFIG.DOUT_WIDTH 1} [get_bd_cells we_odd_1]
create_bd_cell -type ip -vlnv xilinx.com:ip:xlslice:1.0 xlslice_getAccum_rst
set_property -dict {CONFIG.DIN_FROM 1 CONFIG.DIN_TO 1 CONFIG.DOUT_WIDTH 1} [get_bd_cells xlslice_getAccum_rst]
create_bd_cell -type ip -vlnv xilinx.com:ip:xlslice:1.0 xlslice_beat_dphi
set_property -dict {CONFIG.DIN_FROM 19 CONFIG.DIN_TO 4 CONFIG.DOUT_WIDTH 16} [get_bd_cells xlslice_beat_dphi]
create_bd_cell -type ip -vlnv xilinx.com:ip:xlslice:1.0 xlslice_3
set_property -dict {CONFIG.DIN_FROM 23 CONFIG.DIN_TO 16 CONFIG.DOUT_WIDTH 8} [get_bd_cells xlslice_3]
create_bd_cell -type ip -vlnv xilinx.com:ip:xlslice:1.0 we_odd_2
set_property -dict {CONFIG.DIN_FROM 5 CONFIG.DIN_TO 5 CONFIG.DOUT_WIDTH 1} [get_bd_cells we_odd_2]
create_bd_cell -type ip -vlnv xilinx.com:ip:xlslice:1.0 we_odd_12
set_property -dict {CONFIG.DIN_FROM 23 CONFIG.DIN_TO 12 CONFIG.DOUT_WIDTH 12} [get_bd_cells we_odd_12]
create_bd_cell -type ip -vlnv xilinx.com:ip:xlslice:1.0 we_odd_13
set_property -dict {CONFIG.DIN_FROM 11 CONFIG.DIN_TO 0 CONFIG.DOUT_WIDTH 12} [get_bd_cells we_odd_13]
create_bd_cell -type ip -vlnv xilinx.com:ip:xlslice:1.0 we_odd_3
set_property -dict {CONFIG.DIN_FROM 6 CONFIG.DIN_TO 6 CONFIG.DOUT_WIDTH 1} [get_bd_cells we_odd_3]
create_bd_cell -type ip -vlnv xilinx.com:ip:axi_gpio:2.0 axi_gpio_0
set_property -dict [list \
  CONFIG.C_ALL_OUTPUTS 1 \
  CONFIG.C_IS_DUAL 0 \
  CONFIG.GPIO2_BOARD_INTERFACE Custom \
  CONFIG.USE_BOARD_FLOW true \
] [get_bd_cells axi_gpio_0]
create_bd_cell -type ip -vlnv xilinx.com:ip:xlslice:1.0 xlslice_4
set_property -dict {CONFIG.DIN_FROM 15 CONFIG.DOUT_WIDTH 16} [get_bd_cells xlslice_4]
create_bd_cell -type ip -vlnv xilinx.com:ip:axi_gpio:2.0 axi_gpio_1
set_property -dict {CONFIG.C_ALL_OUTPUTS 1 CONFIG.C_ALL_OUTPUTS_2 1 CONFIG.C_IS_DUAL 1} [get_bd_cells axi_gpio_1]
create_bd_cell -type ip -vlnv xilinx.com:ip:xlslice:1.0 we_odd_4
set_property -dict {CONFIG.DIN_FROM 7 CONFIG.DIN_TO 7 CONFIG.DOUT_WIDTH 1} [get_bd_cells we_odd_4]
create_bd_cell -type ip -vlnv xilinx.com:ip:xlslice:1.0 we_odd_14
set_property -dict {CONFIG.DIN_FROM 23 CONFIG.DIN_TO 12 CONFIG.DOUT_WIDTH 12} [get_bd_cells we_odd_14]
create_bd_cell -type ip -vlnv xilinx.com:ip:xlslice:1.0 we_odd_5
set_property -dict {CONFIG.DIN_FROM 0 CONFIG.DIN_TO 0 CONFIG.DOUT_WIDTH 1} [get_bd_cells we_odd_5]
create_bd_cell -type ip -vlnv xilinx.com:ip:axi_gpio:2.0 axi_gpio_2
set_property -dict {CONFIG.C_ALL_OUTPUTS 1 CONFIG.C_ALL_OUTPUTS_2 1 CONFIG.C_IS_DUAL 1} [get_bd_cells axi_gpio_2]
create_bd_cell -type ip -vlnv xilinx.com:ip:xlslice:1.0 xlslice_bin_sel_addr
set_property -dict {CONFIG.DIN_FROM 9 CONFIG.DIN_TO 0 CONFIG.DOUT_WIDTH 10} [get_bd_cells xlslice_bin_sel_addr]
create_bd_cell -type ip -vlnv xilinx.com:ip:axi_gpio:2.0 axi_gpio_3
set_property -dict {CONFIG.C_ALL_OUTPUTS 1 CONFIG.C_ALL_OUTPUTS_2 1 CONFIG.C_IS_DUAL 1} [get_bd_cells axi_gpio_3]
create_bd_cell -type ip -vlnv xilinx.com:ip:xlslice:1.0 reset
set_property -dict {CONFIG.DIN_FROM 1 CONFIG.DIN_TO 1 CONFIG.DOUT_WIDTH 1} [get_bd_cells reset]
create_bd_cell -type ip -vlnv xilinx.com:ip:xlslice:1.0 we_odd_6
set_property -dict {CONFIG.DIN_FROM 7 CONFIG.DIN_TO 0 CONFIG.DOUT_WIDTH 8} [get_bd_cells we_odd_6]
create_bd_cell -type ip -vlnv xilinx.com:ip:xlslice:1.0 xlslice_bin_sel_data0
set_property -dict {CONFIG.DIN_FROM 31 CONFIG.DIN_TO 10 CONFIG.DOUT_WIDTH 22} [get_bd_cells xlslice_bin_sel_data0]
create_bd_cell -type ip -vlnv xilinx.com:ip:xlslice:1.0 we_odd_7
set_property -dict {CONFIG.DIN_FROM 11 CONFIG.DIN_TO 0 CONFIG.DOUT_WIDTH 12} [get_bd_cells we_odd_7]
create_bd_cell -type ip -vlnv xilinx.com:ip:axi_gpio:2.0 axi_gpio_4
set_property -dict {CONFIG.C_ALL_OUTPUTS 1 CONFIG.C_ALL_OUTPUTS_2 1 CONFIG.C_IS_DUAL 1} [get_bd_cells axi_gpio_4]
create_bd_cell -type ip -vlnv xilinx.com:ip:axi_gpio:2.0 axi_gpio_10
set_property -dict {CONFIG.C_ALL_OUTPUTS 1 CONFIG.C_IS_DUAL 0} [get_bd_cells axi_gpio_10]
create_bd_cell -type ip -vlnv xilinx.com:ip:xlslice:1.0 xlslice_acc_length
set_property -dict {CONFIG.DIN_FROM 22 CONFIG.DIN_TO 0 CONFIG.DOUT_WIDTH 23} [get_bd_cells xlslice_acc_length]
create_bd_cell -type ip -vlnv xilinx.com:ip:xlslice:1.0 we_odd_8
set_property -dict {CONFIG.DIN_FROM 23 CONFIG.DIN_TO 12 CONFIG.DOUT_WIDTH 12} [get_bd_cells we_odd_8]
create_bd_cell -type ip -vlnv xilinx.com:ip:xlslice:1.0 xlslice_bin_sel_data1
set_property -dict {CONFIG.DIN_FROM 22 CONFIG.DIN_TO 1 CONFIG.DOUT_WIDTH 22} [get_bd_cells xlslice_bin_sel_data1]
create_bd_cell -type ip -vlnv xilinx.com:ip:xlslice:1.0 xlslice_bramx32v2_start
set_property -dict {CONFIG.DIN_FROM 0 CONFIG.DIN_TO 0 CONFIG.DOUT_WIDTH 1} [get_bd_cells xlslice_bramx32v2_start]
create_bd_cell -type ip -vlnv xilinx.com:ip:axi_gpio:2.0 axi_gpio_5
set_property -dict [list \
  CONFIG.C_ALL_INPUTS 0 \
  CONFIG.C_ALL_INPUTS_2 1 \
  CONFIG.C_ALL_OUTPUTS 1 \
  CONFIG.C_IS_DUAL 1 \
] [get_bd_cells axi_gpio_5]
create_bd_cell -type ip -vlnv xilinx.com:ip:xlslice:1.0 xlslice_PSBscaleC
set_property -dict {CONFIG.DIN_FROM 28 CONFIG.DIN_TO 0 CONFIG.DOUT_WIDTH 29} [get_bd_cells xlslice_PSBscaleC]
create_bd_cell -type ip -vlnv xilinx.com:ip:xlslice:1.0 xlslice_ov_rst
set_property -dict {CONFIG.DIN_FROM 31 CONFIG.DIN_TO 29 CONFIG.DOUT_WIDTH 3} [get_bd_cells xlslice_ov_rst]

# ---- hierarchy /chan2/psb_out_post ----
current_bd_instance /chan2/psb_out_post
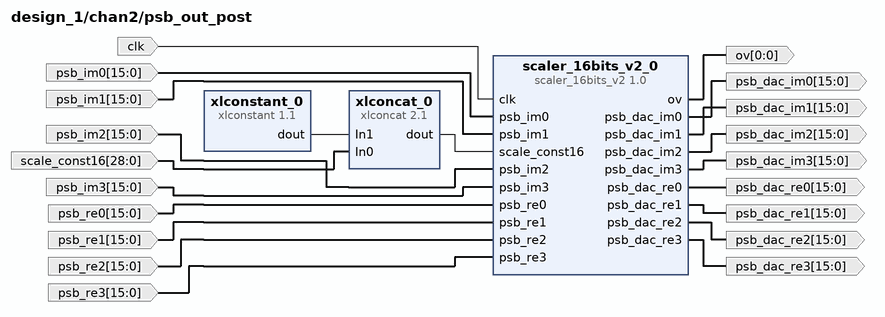
[diagram p17: block diagram inside /chan2/psb_out_post]
create_bd_pin -dir I -from 15 -to 0 psb_im0
create_bd_pin -dir I -from 15 -to 0 psb_im1
create_bd_pin -dir I -from 15 -to 0 psb_im2
create_bd_pin -dir I -from 15 -to 0 psb_im3
create_bd_pin -dir I -from 15 -to 0 psb_re0
create_bd_pin -dir I -from 15 -to 0 psb_re1
create_bd_pin -dir I -from 15 -to 0 psb_re2
create_bd_pin -dir I -from 15 -to 0 psb_re3
create_bd_pin -dir I -from 28 -to 0 scale_const16
create_bd_pin -dir I -type clk clk
create_bd_pin -dir O -from 15 -to 0 psb_dac_im0
create_bd_pin -dir O -from 15 -to 0 psb_dac_im1
create_bd_pin -dir O -from 15 -to 0 psb_dac_im2
create_bd_pin -dir O -from 15 -to 0 psb_dac_im3
create_bd_pin -dir O -from 15 -to 0 psb_dac_re0
create_bd_pin -dir O -from 15 -to 0 psb_dac_re1
create_bd_pin -dir O -from 15 -to 0 psb_dac_re2
create_bd_pin -dir O -from 15 -to 0 psb_dac_re3
create_bd_pin -dir O -from 0 -to 0 ov

create_bd_cell -type ip -vlnv xilinx.com:user:scaler_16bits_v2:1.0 scaler_16bits_v2_0
create_bd_cell -type ip -vlnv xilinx.com:ip:xlconcat:2.1 xlconcat_0
set_property -dict {CONFIG.IN0_WIDTH 29 CONFIG.IN1_WIDTH 3} [get_bd_cells xlconcat_0]
create_bd_cell -type ip -vlnv xilinx.com:ip:xlconstant:1.1 xlconstant_0
set_property -dict {CONFIG.CONST_VAL 0 CONFIG.CONST_WIDTH 3} [get_bd_cells xlconstant_0]

# ---- hierarchy /chan2/fine_nco ----
current_bd_instance /chan2/fine_nco
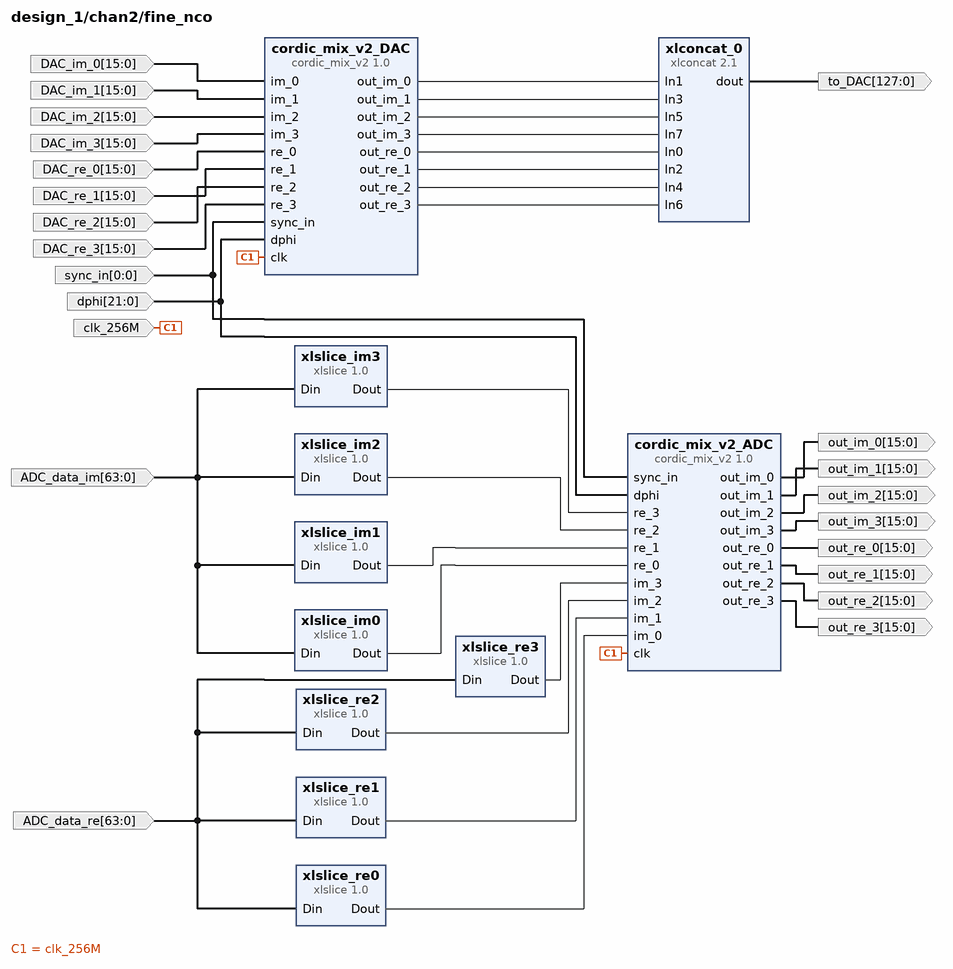
[diagram p18: block diagram inside /chan2/fine_nco]
create_bd_pin -dir I -from 63 -to 0 ADC_data_im
create_bd_pin -dir O -from 127 -to 0 to_DAC
create_bd_pin -dir I -from 63 -to 0 ADC_data_re
create_bd_pin -dir I -from 21 -to 0 dphi
create_bd_pin -dir I -from 0 -to 0 sync_in
create_bd_pin -dir I -type clk clk_256M
create_bd_pin -dir O -from 15 -to 0 out_im_0
create_bd_pin -dir O -from 15 -to 0 out_im_1
create_bd_pin -dir O -from 15 -to 0 out_im_2
create_bd_pin -dir O -from 15 -to 0 out_im_3
create_bd_pin -dir O -from 15 -to 0 out_re_0
create_bd_pin -dir O -from 15 -to 0 out_re_1
create_bd_pin -dir O -from 15 -to 0 out_re_2
create_bd_pin -dir O -from 15 -to 0 out_re_3
create_bd_pin -dir I -from 15 -to 0 DAC_im_0
create_bd_pin -dir I -from 15 -to 0 DAC_im_1
create_bd_pin -dir I -from 15 -to 0 DAC_im_2
create_bd_pin -dir I -from 15 -to 0 DAC_im_3
create_bd_pin -dir I -from 15 -to 0 DAC_re_0
create_bd_pin -dir I -from 15 -to 0 DAC_re_1
create_bd_pin -dir I -from 15 -to 0 DAC_re_2
create_bd_pin -dir I -from 15 -to 0 DAC_re_3

create_bd_cell -type ip -vlnv xilinx.com:ip:xlslice:1.0 xlslice_im0
set_property -dict {CONFIG.DIN_FROM 15 CONFIG.DIN_TO 0 CONFIG.DIN_WIDTH 64 CONFIG.DOUT_WIDTH 16} [get_bd_cells xlslice_im0]
create_bd_cell -type ip -vlnv xilinx.com:ip:xlslice:1.0 xlslice_im1
set_property -dict {CONFIG.DIN_FROM 31 CONFIG.DIN_TO 16 CONFIG.DIN_WIDTH 64 CONFIG.DOUT_WIDTH 16} [get_bd_cells xlslice_im1]
create_bd_cell -type ip -vlnv xilinx.com:ip:xlslice:1.0 xlslice_im2
set_property -dict {CONFIG.DIN_FROM 47 CONFIG.DIN_TO 32 CONFIG.DIN_WIDTH 64 CONFIG.DOUT_WIDTH 16} [get_bd_cells xlslice_im2]
create_bd_cell -type ip -vlnv xilinx.com:ip:xlconcat:2.1 xlconcat_0
set_property -dict [list \
  CONFIG.IN2_WIDTH 16 \
  CONFIG.IN3_WIDTH 16 \
  CONFIG.IN4_WIDTH 16 \
  CONFIG.IN5_WIDTH 16 \
  CONFIG.IN6_WIDTH 16 \
  CONFIG.IN7_WIDTH 16 \
  CONFIG.NUM_PORTS 8 \
] [get_bd_cells xlconcat_0]
create_bd_cell -type ip -vlnv xilinx.com:ip:xlslice:1.0 xlslice_re0
set_property -dict {CONFIG.DIN_FROM 15 CONFIG.DIN_TO 0 CONFIG.DIN_WIDTH 64 CONFIG.DOUT_WIDTH 16} [get_bd_cells xlslice_re0]
create_bd_cell -type ip -vlnv xilinx.com:ip:xlslice:1.0 xlslice_im3
set_property -dict {CONFIG.DIN_FROM 63 CONFIG.DIN_TO 48 CONFIG.DIN_WIDTH 64 CONFIG.DOUT_WIDTH 16} [get_bd_cells xlslice_im3]
create_bd_cell -type ip -vlnv xilinx.com:ip:xlslice:1.0 xlslice_re1
set_property -dict {CONFIG.DIN_FROM 31 CONFIG.DIN_TO 16 CONFIG.DIN_WIDTH 64 CONFIG.DOUT_WIDTH 16} [get_bd_cells xlslice_re1]
create_bd_cell -type ip -vlnv xilinx.com:ip:xlslice:1.0 xlslice_re2
set_property -dict {CONFIG.DIN_FROM 47 CONFIG.DIN_TO 32 CONFIG.DIN_WIDTH 64 CONFIG.DOUT_WIDTH 16} [get_bd_cells xlslice_re2]
create_bd_cell -type ip -vlnv xilinx.com:user:cordic_mix_v2:1.0 cordic_mix_v2_ADC
create_bd_cell -type ip -vlnv xilinx.com:user:cordic_mix_v2:1.0 cordic_mix_v2_DAC
create_bd_cell -type ip -vlnv xilinx.com:ip:xlslice:1.0 xlslice_re3
set_property -dict {CONFIG.DIN_FROM 63 CONFIG.DIN_TO 48 CONFIG.DIN_WIDTH 64 CONFIG.DOUT_WIDTH 16} [get_bd_cells xlslice_re3]

# ---- hierarchy /chan2/overflow_management ----
current_bd_instance /chan2/overflow_management
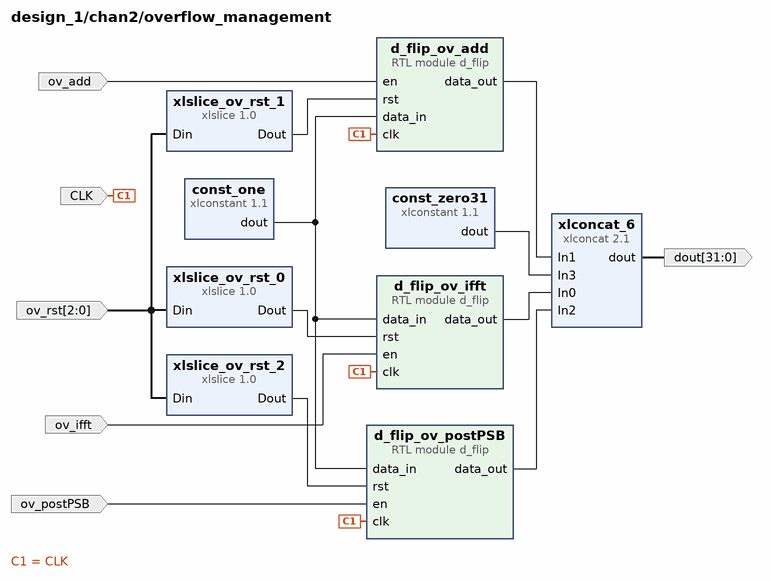
[diagram p19: block diagram inside /chan2/overflow_management]
create_bd_pin -dir I -type clk CLK
create_bd_pin -dir O -from 31 -to 0 dout
create_bd_pin -dir I ov_add
create_bd_pin -dir I ov_ifft
create_bd_pin -dir I ov_postPSB
create_bd_pin -dir I -from 2 -to 0 ov_rst

create_bd_cell -type ip -vlnv xilinx.com:ip:xlconstant:1.1 const_one
set_property -dict {CONFIG.CONST_VAL 1 CONFIG.CONST_WIDTH 1} [get_bd_cells const_one]
create_bd_cell -type ip -vlnv xilinx.com:ip:xlconstant:1.1 const_zero31
set_property -dict {CONFIG.CONST_VAL 0 CONFIG.CONST_WIDTH 29} [get_bd_cells const_zero31]
create_bd_cell -type module -reference d_flip d_flip_ov_add
set_property -dict {CONFIG.width 1} [get_bd_cells d_flip_ov_add]
create_bd_cell -type module -reference d_flip d_flip_ov_ifft
set_property -dict {CONFIG.width 1} [get_bd_cells d_flip_ov_ifft]
create_bd_cell -type module -reference d_flip d_flip_ov_postPSB
set_property -dict {CONFIG.width 1} [get_bd_cells d_flip_ov_postPSB]
create_bd_cell -type ip -vlnv xilinx.com:ip:xlconcat:2.1 xlconcat_6
set_property -dict [list \
  CONFIG.IN0_WIDTH 1 \
  CONFIG.IN1_WIDTH 1 \
  CONFIG.IN2_WIDTH 1 \
  CONFIG.IN3_WIDTH 29 \
  CONFIG.IN4_WIDTH 16 \
  CONFIG.IN5_WIDTH 16 \
  CONFIG.IN6_WIDTH 16 \
  CONFIG.IN7_WIDTH 16 \
  CONFIG.NUM_PORTS 4 \
] [get_bd_cells xlconcat_6]
create_bd_cell -type ip -vlnv xilinx.com:ip:xlslice:1.0 xlslice_ov_rst_0
set_property -dict {CONFIG.DIN_FROM 0 CONFIG.DIN_TO 0 CONFIG.DIN_WIDTH 3 CONFIG.DOUT_WIDTH 1} [get_bd_cells xlslice_ov_rst_0]
create_bd_cell -type ip -vlnv xilinx.com:ip:xlslice:1.0 xlslice_ov_rst_1
set_property -dict {CONFIG.DIN_FROM 1 CONFIG.DIN_TO 1 CONFIG.DIN_WIDTH 3 CONFIG.DOUT_WIDTH 1} [get_bd_cells xlslice_ov_rst_1]
create_bd_cell -type ip -vlnv xilinx.com:ip:xlslice:1.0 xlslice_ov_rst_2
set_property -dict {CONFIG.DIN_FROM 2 CONFIG.DIN_TO 2 CONFIG.DIN_WIDTH 3 CONFIG.DOUT_WIDTH 1} [get_bd_cells xlslice_ov_rst_2]

# ---- hierarchy /chan3 ----
current_bd_instance /chan3
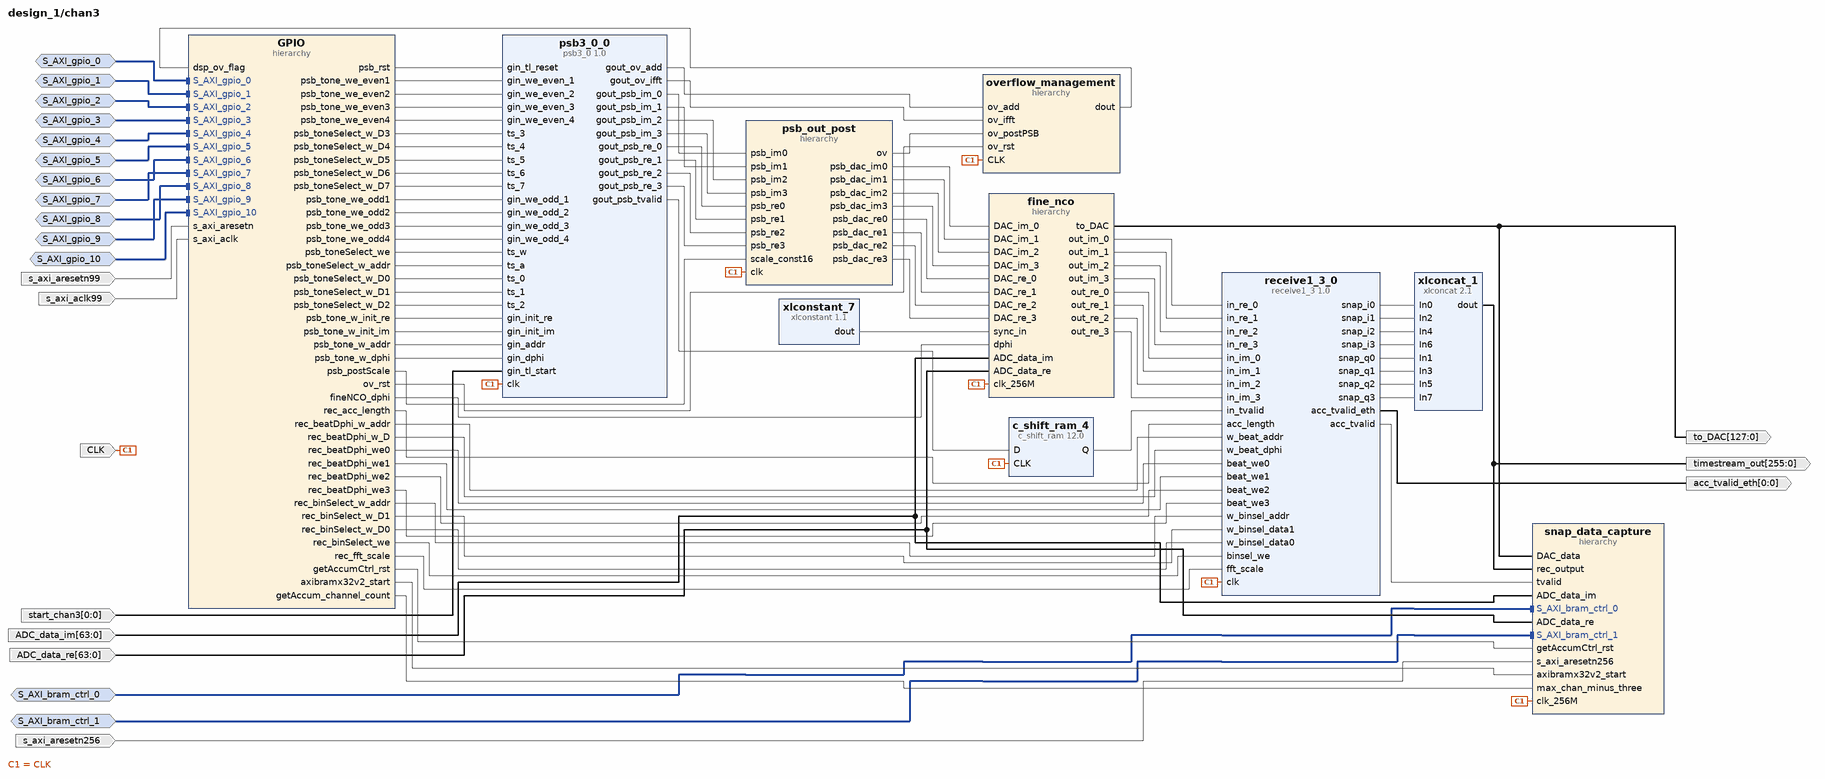
[diagram p20: block diagram inside /chan3]
create_bd_intf_pin -mode Slave -vlnv xilinx.com:interface:aximm_rtl:1.0 S_AXI_bram_ctrl_0
create_bd_intf_pin -mode Slave -vlnv xilinx.com:interface:aximm_rtl:1.0 S_AXI_bram_ctrl_1
create_bd_intf_pin -mode Slave -vlnv xilinx.com:interface:aximm_rtl:1.0 S_AXI_gpio_6
create_bd_intf_pin -mode Slave -vlnv xilinx.com:interface:aximm_rtl:1.0 S_AXI_gpio_7
create_bd_intf_pin -mode Slave -vlnv xilinx.com:interface:aximm_rtl:1.0 S_AXI_gpio_8
create_bd_intf_pin -mode Slave -vlnv xilinx.com:interface:aximm_rtl:1.0 S_AXI_gpio_9
create_bd_intf_pin -mode Slave -vlnv xilinx.com:interface:aximm_rtl:1.0 S_AXI_gpio_0
create_bd_intf_pin -mode Slave -vlnv xilinx.com:interface:aximm_rtl:1.0 S_AXI_gpio_1
create_bd_intf_pin -mode Slave -vlnv xilinx.com:interface:aximm_rtl:1.0 S_AXI_gpio_2
create_bd_intf_pin -mode Slave -vlnv xilinx.com:interface:aximm_rtl:1.0 S_AXI_gpio_3
create_bd_intf_pin -mode Slave -vlnv xilinx.com:interface:aximm_rtl:1.0 S_AXI_gpio_4
create_bd_intf_pin -mode Slave -vlnv xilinx.com:interface:aximm_rtl:1.0 S_AXI_gpio_10
create_bd_intf_pin -mode Slave -vlnv xilinx.com:interface:aximm_rtl:1.0 S_AXI_gpio_5
create_bd_pin -dir I -type clk CLK
create_bd_pin -dir O -from 0 -to 0 acc_tvalid_eth
create_bd_pin -dir O -from 255 -to 0 -type data timestream_out
create_bd_pin -dir I -from 63 -to 0 ADC_data_re
create_bd_pin -dir I -type rst s_axi_aresetn256
create_bd_pin -dir I -from 63 -to 0 ADC_data_im
create_bd_pin -dir O -from 127 -to 0 to_DAC
create_bd_pin -dir I -type clk s_axi_aclk99
create_bd_pin -dir I -type rst s_axi_aresetn99
create_bd_pin -dir I -from 0 -to 0 start_chan3

create_bd_cell -type ip -vlnv xilinx.com:user:receive1_3:1.0 receive1_3_0
create_bd_cell -type ip -vlnv xilinx.com:ip:c_shift_ram:12.0 c_shift_ram_4
set_property -dict {CONFIG.AsyncInitVal 0 CONFIG.DefaultData 0 CONFIG.Depth 1024 CONFIG.Width 1} [get_bd_cells c_shift_ram_4]
create_bd_cell -type ip -vlnv xilinx.com:ip:xlconcat:2.1 xlconcat_1
set_property -dict [list \
  CONFIG.IN0_WIDTH 32 \
  CONFIG.IN1_WIDTH 32 \
  CONFIG.IN2_WIDTH 32 \
  CONFIG.IN3_WIDTH 32 \
  CONFIG.IN4_WIDTH 32 \
  CONFIG.IN5_WIDTH 32 \
  CONFIG.IN6_WIDTH 32 \
  CONFIG.IN7_WIDTH 32 \
  CONFIG.NUM_PORTS 8 \
] [get_bd_cells xlconcat_1]
create_bd_cell -type ip -vlnv xilinx.com:user:psb3_0:1.0 psb3_0_0
create_bd_cell -type ip -vlnv xilinx.com:ip:xlconstant:1.1 xlconstant_7
set_property -dict {CONFIG.CONST_VAL 1 CONFIG.CONST_WIDTH 1} [get_bd_cells xlconstant_7]
create_bd_cell -type hier snap_data_capture
create_bd_cell -type hier GPIO
create_bd_cell -type hier psb_out_post
create_bd_cell -type hier fine_nco
create_bd_cell -type hier overflow_management

# ---- hierarchy /chan3/snap_data_capture ----
current_bd_instance /chan3/snap_data_capture
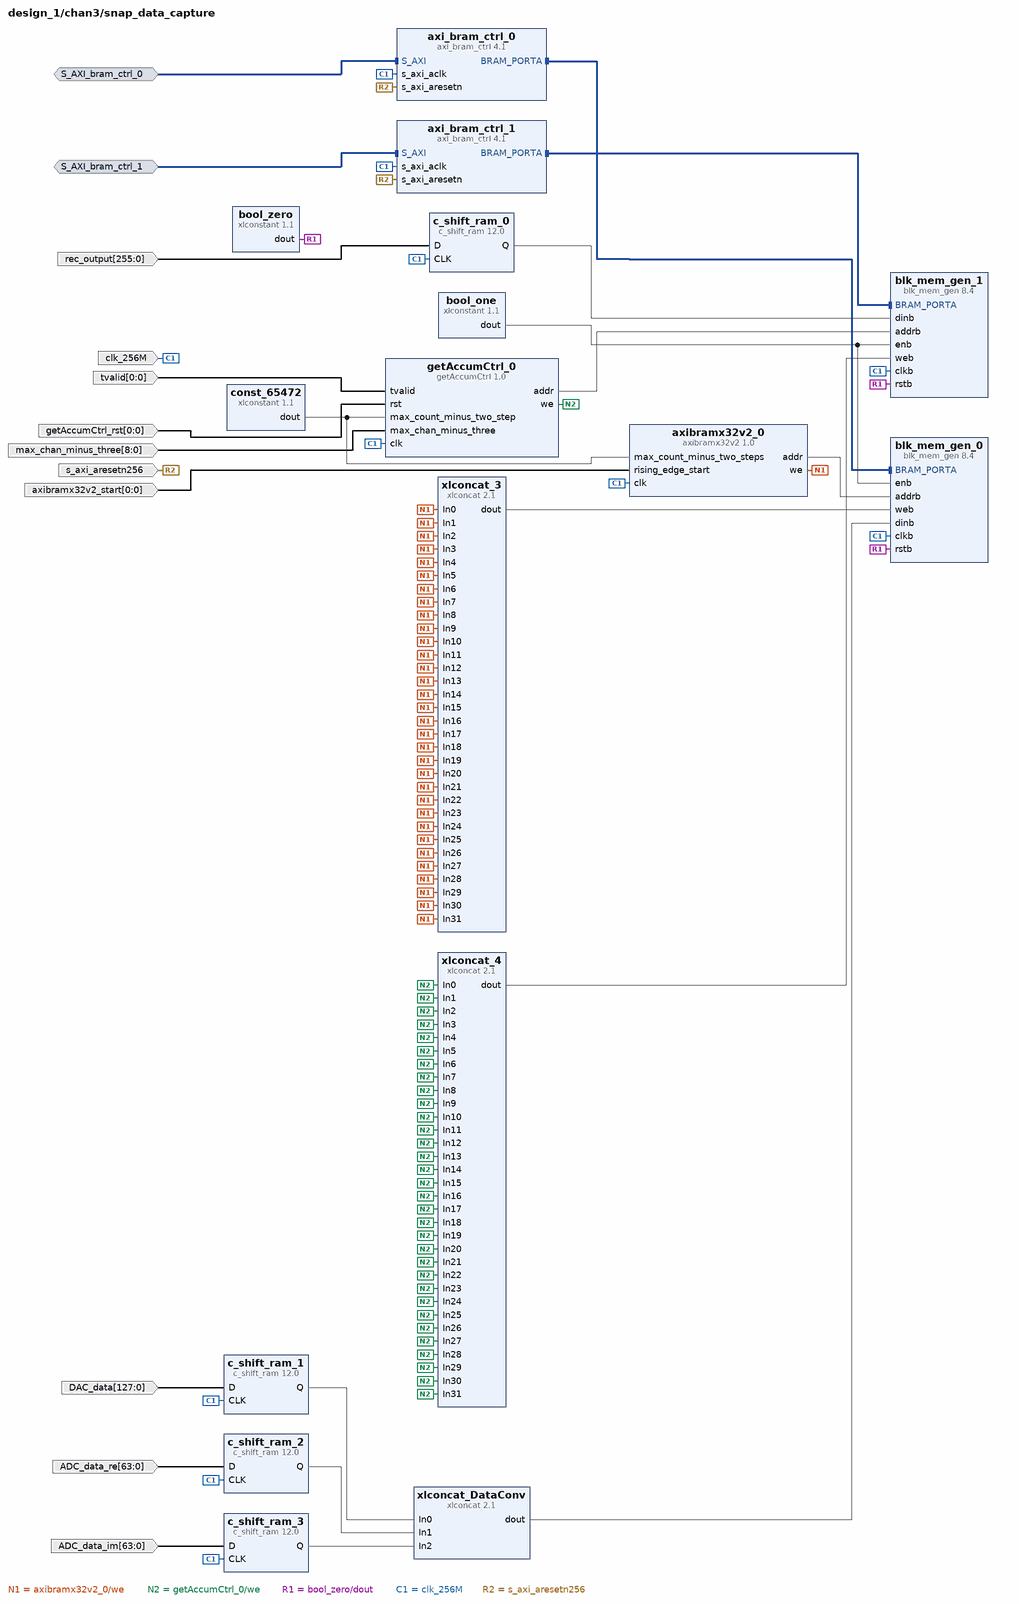
[diagram p21: block diagram inside /chan3/snap_data_capture]
create_bd_intf_pin -mode Slave -vlnv xilinx.com:interface:aximm_rtl:1.0 S_AXI_bram_ctrl_0
create_bd_intf_pin -mode Slave -vlnv xilinx.com:interface:aximm_rtl:1.0 S_AXI_bram_ctrl_1
create_bd_pin -dir I -from 63 -to 0 -type data ADC_data_re
create_bd_pin -dir I -type clk clk_256M
create_bd_pin -dir I -type rst s_axi_aresetn256
create_bd_pin -dir I -from 63 -to 0 -type data ADC_data_im
create_bd_pin -dir I -from 8 -to 0 max_chan_minus_three
create_bd_pin -dir I -from 0 -to 0 getAccumCtrl_rst
create_bd_pin -dir I -from 0 -to 0 tvalid
create_bd_pin -dir I -from 255 -to 0 -type data rec_output
create_bd_pin -dir I -from 127 -to 0 -type data DAC_data
create_bd_pin -dir I -from 0 -to 0 axibramx32v2_start

create_bd_cell -type ip -vlnv xilinx.com:ip:xlconstant:1.1 const_65472
set_property -dict {CONFIG.CONST_VAL 65472 CONFIG.CONST_WIDTH 32} [get_bd_cells const_65472]
create_bd_cell -type ip -vlnv xilinx.com:ip:c_shift_ram:12.0 c_shift_ram_2
set_property -dict [list \
  CONFIG.AsyncInitVal 0000000000000000000000000000000000000000000000000000000000000000 \
  CONFIG.DefaultData 0000000000000000000000000000000000000000000000000000000000000000 \
  CONFIG.Depth 2 \
  CONFIG.Width 64 \
] [get_bd_cells c_shift_ram_2]
create_bd_cell -type ip -vlnv xilinx.com:ip:axi_bram_ctrl:4.1 axi_bram_ctrl_0
set_property -dict {CONFIG.DATA_WIDTH 256 CONFIG.SINGLE_PORT_BRAM 1} [get_bd_cells axi_bram_ctrl_0]
create_bd_cell -type ip -vlnv xilinx.com:ip:axi_bram_ctrl:4.1 axi_bram_ctrl_1
set_property -dict {CONFIG.DATA_WIDTH 256 CONFIG.SINGLE_PORT_BRAM 1} [get_bd_cells axi_bram_ctrl_1]
create_bd_cell -type ip -vlnv xilinx.com:ip:c_shift_ram:12.0 c_shift_ram_3
set_property -dict [list \
  CONFIG.AsyncInitVal 0000000000000000000000000000000000000000000000000000000000000000 \
  CONFIG.DefaultData 0000000000000000000000000000000000000000000000000000000000000000 \
  CONFIG.Depth 2 \
  CONFIG.Width 64 \
] [get_bd_cells c_shift_ram_3]
create_bd_cell -type ip -vlnv xilinx.com:user:getAccumCtrl:1.0 getAccumCtrl_0
create_bd_cell -type ip -vlnv xilinx.com:ip:xlconstant:1.1 bool_zero
set_property -dict {CONFIG.CONST_VAL 0 CONFIG.CONST_WIDTH 1} [get_bd_cells bool_zero]
create_bd_cell -type ip -vlnv xilinx.com:ip:xlconcat:2.1 xlconcat_3
set_property -dict [list \
  CONFIG.IN0_WIDTH 1 \
  CONFIG.IN10_WIDTH 1 \
  CONFIG.IN11_WIDTH 1 \
  CONFIG.IN12_WIDTH 1 \
  CONFIG.IN13_WIDTH 1 \
  CONFIG.IN14_WIDTH 1 \
  CONFIG.IN15_WIDTH 1 \
  CONFIG.IN16_WIDTH 1 \
  CONFIG.IN17_WIDTH 1 \
  CONFIG.IN18_WIDTH 1 \
  CONFIG.IN19_WIDTH 1 \
  CONFIG.IN1_WIDTH 1 \
  CONFIG.IN20_WIDTH 1 \
  CONFIG.IN21_WIDTH 1 \
  CONFIG.IN22_WIDTH 1 \
  CONFIG.IN23_WIDTH 1 \
  CONFIG.IN24_WIDTH 1 \
  CONFIG.IN25_WIDTH 1 \
  CONFIG.IN26_WIDTH 1 \
  CONFIG.IN27_WIDTH 1 \
  CONFIG.IN28_WIDTH 1 \
  CONFIG.IN29_WIDTH 1 \
  CONFIG.IN2_WIDTH 1 \
  CONFIG.IN30_WIDTH 1 \
  CONFIG.IN31_WIDTH 1 \
  CONFIG.IN3_WIDTH 1 \
  CONFIG.IN4_WIDTH 1 \
  CONFIG.IN5_WIDTH 1 \
  CONFIG.IN6_WIDTH 1 \
  CONFIG.IN7_WIDTH 1 \
  CONFIG.IN8_WIDTH 1 \
  CONFIG.IN9_WIDTH 1 \
  CONFIG.NUM_PORTS 32 \
] [get_bd_cells xlconcat_3]
create_bd_cell -type ip -vlnv xilinx.com:ip:blk_mem_gen:8.4 blk_mem_gen_0
set_property -dict [list \
  CONFIG.Enable_32bit_Address true \
  CONFIG.Memory_Type True_Dual_Port_RAM \
  CONFIG.PRIM_type_to_Implement URAM \
  CONFIG.Port_B_Clock 100 \
  CONFIG.Port_B_Enable_Rate 100 \
  CONFIG.Port_B_Write_Rate 50 \
  CONFIG.Use_RSTA_Pin true \
  CONFIG.Use_RSTB_Pin true \
  CONFIG.Write_Width_A 256 \
  CONFIG.use_bram_block BRAM_Controller \
] [get_bd_cells blk_mem_gen_0]
create_bd_cell -type ip -vlnv xilinx.com:ip:blk_mem_gen:8.4 blk_mem_gen_1
set_property -dict [list \
  CONFIG.Enable_32bit_Address true \
  CONFIG.Memory_Type True_Dual_Port_RAM \
  CONFIG.PRIM_type_to_Implement URAM \
  CONFIG.Port_B_Clock 100 \
  CONFIG.Port_B_Enable_Rate 100 \
  CONFIG.Port_B_Write_Rate 50 \
  CONFIG.Use_RSTA_Pin true \
  CONFIG.Use_RSTB_Pin true \
  CONFIG.Write_Width_A 256 \
  CONFIG.use_bram_block BRAM_Controller \
] [get_bd_cells blk_mem_gen_1]
create_bd_cell -type ip -vlnv xilinx.com:ip:xlconstant:1.1 bool_one
set_property -dict {CONFIG.CONST_VAL 1 CONFIG.CONST_WIDTH 1} [get_bd_cells bool_one]
create_bd_cell -type ip -vlnv xilinx.com:ip:xlconcat:2.1 xlconcat_DataConv
set_property -dict [list \
  CONFIG.IN0_WIDTH 128 \
  CONFIG.IN1_WIDTH 64 \
  CONFIG.IN2_WIDTH 64 \
  CONFIG.IN3_WIDTH 32 \
  CONFIG.IN4_WIDTH 32 \
  CONFIG.IN5_WIDTH 32 \
  CONFIG.IN6_WIDTH 32 \
  CONFIG.IN7_WIDTH 32 \
  CONFIG.NUM_PORTS 3 \
] [get_bd_cells xlconcat_DataConv]
create_bd_cell -type ip -vlnv xilinx.com:ip:c_shift_ram:12.0 c_shift_ram_0
set_property -dict [list \
  CONFIG.AsyncInitVal 0000000000000000000000000000000000000000000000000000000000000000000000000000000000000000000000000000000000000000000000000000000000000000000000000000000000000000000000000000000000000000000000000000000000000000000000000000000000000000000000000000000000000000 \
  CONFIG.DefaultData 0000000000000000000000000000000000000000000000000000000000000000000000000000000000000000000000000000000000000000000000000000000000000000000000000000000000000000000000000000000000000000000000000000000000000000000000000000000000000000000000000000000000000000 \
  CONFIG.Depth 3 \
  CONFIG.Width 256 \
] [get_bd_cells c_shift_ram_0]
create_bd_cell -type ip -vlnv xilinx.com:ip:c_shift_ram:12.0 c_shift_ram_1
set_property -dict [list \
  CONFIG.AsyncInitVal 00000000000000000000000000000000000000000000000000000000000000000000000000000000000000000000000000000000000000000000000000000000 \
  CONFIG.DefaultData 00000000000000000000000000000000000000000000000000000000000000000000000000000000000000000000000000000000000000000000000000000000 \
  CONFIG.Depth 2 \
  CONFIG.Width 128 \
] [get_bd_cells c_shift_ram_1]
create_bd_cell -type ip -vlnv xilinx.com:user:axibramx32v2:1.0 axibramx32v2_0
create_bd_cell -type ip -vlnv xilinx.com:ip:xlconcat:2.1 xlconcat_4
set_property -dict [list \
  CONFIG.IN0_WIDTH 1 \
  CONFIG.IN10_WIDTH 1 \
  CONFIG.IN11_WIDTH 1 \
  CONFIG.IN12_WIDTH 1 \
  CONFIG.IN13_WIDTH 1 \
  CONFIG.IN14_WIDTH 1 \
  CONFIG.IN15_WIDTH 1 \
  CONFIG.IN16_WIDTH 1 \
  CONFIG.IN17_WIDTH 1 \
  CONFIG.IN18_WIDTH 1 \
  CONFIG.IN19_WIDTH 1 \
  CONFIG.IN1_WIDTH 1 \
  CONFIG.IN20_WIDTH 1 \
  CONFIG.IN21_WIDTH 1 \
  CONFIG.IN22_WIDTH 1 \
  CONFIG.IN23_WIDTH 1 \
  CONFIG.IN24_WIDTH 1 \
  CONFIG.IN25_WIDTH 1 \
  CONFIG.IN26_WIDTH 1 \
  CONFIG.IN27_WIDTH 1 \
  CONFIG.IN28_WIDTH 1 \
  CONFIG.IN29_WIDTH 1 \
  CONFIG.IN2_WIDTH 1 \
  CONFIG.IN30_WIDTH 1 \
  CONFIG.IN31_WIDTH 1 \
  CONFIG.IN3_WIDTH 1 \
  CONFIG.IN4_WIDTH 1 \
  CONFIG.IN5_WIDTH 1 \
  CONFIG.IN6_WIDTH 1 \
  CONFIG.IN7_WIDTH 1 \
  CONFIG.IN8_WIDTH 1 \
  CONFIG.IN9_WIDTH 1 \
  CONFIG.NUM_PORTS 32 \
] [get_bd_cells xlconcat_4]
